# Altium project ANT_Miner_V1.3.PrjPCB (part 2 of 2)

## Sheet HashUnit2.SchDoc: ANT_Miner_V1.3
size A2; Date: 2013/11/20; DrawnBy: Bitmain Technology; SheetNumber: 7; SheetTotal: 9
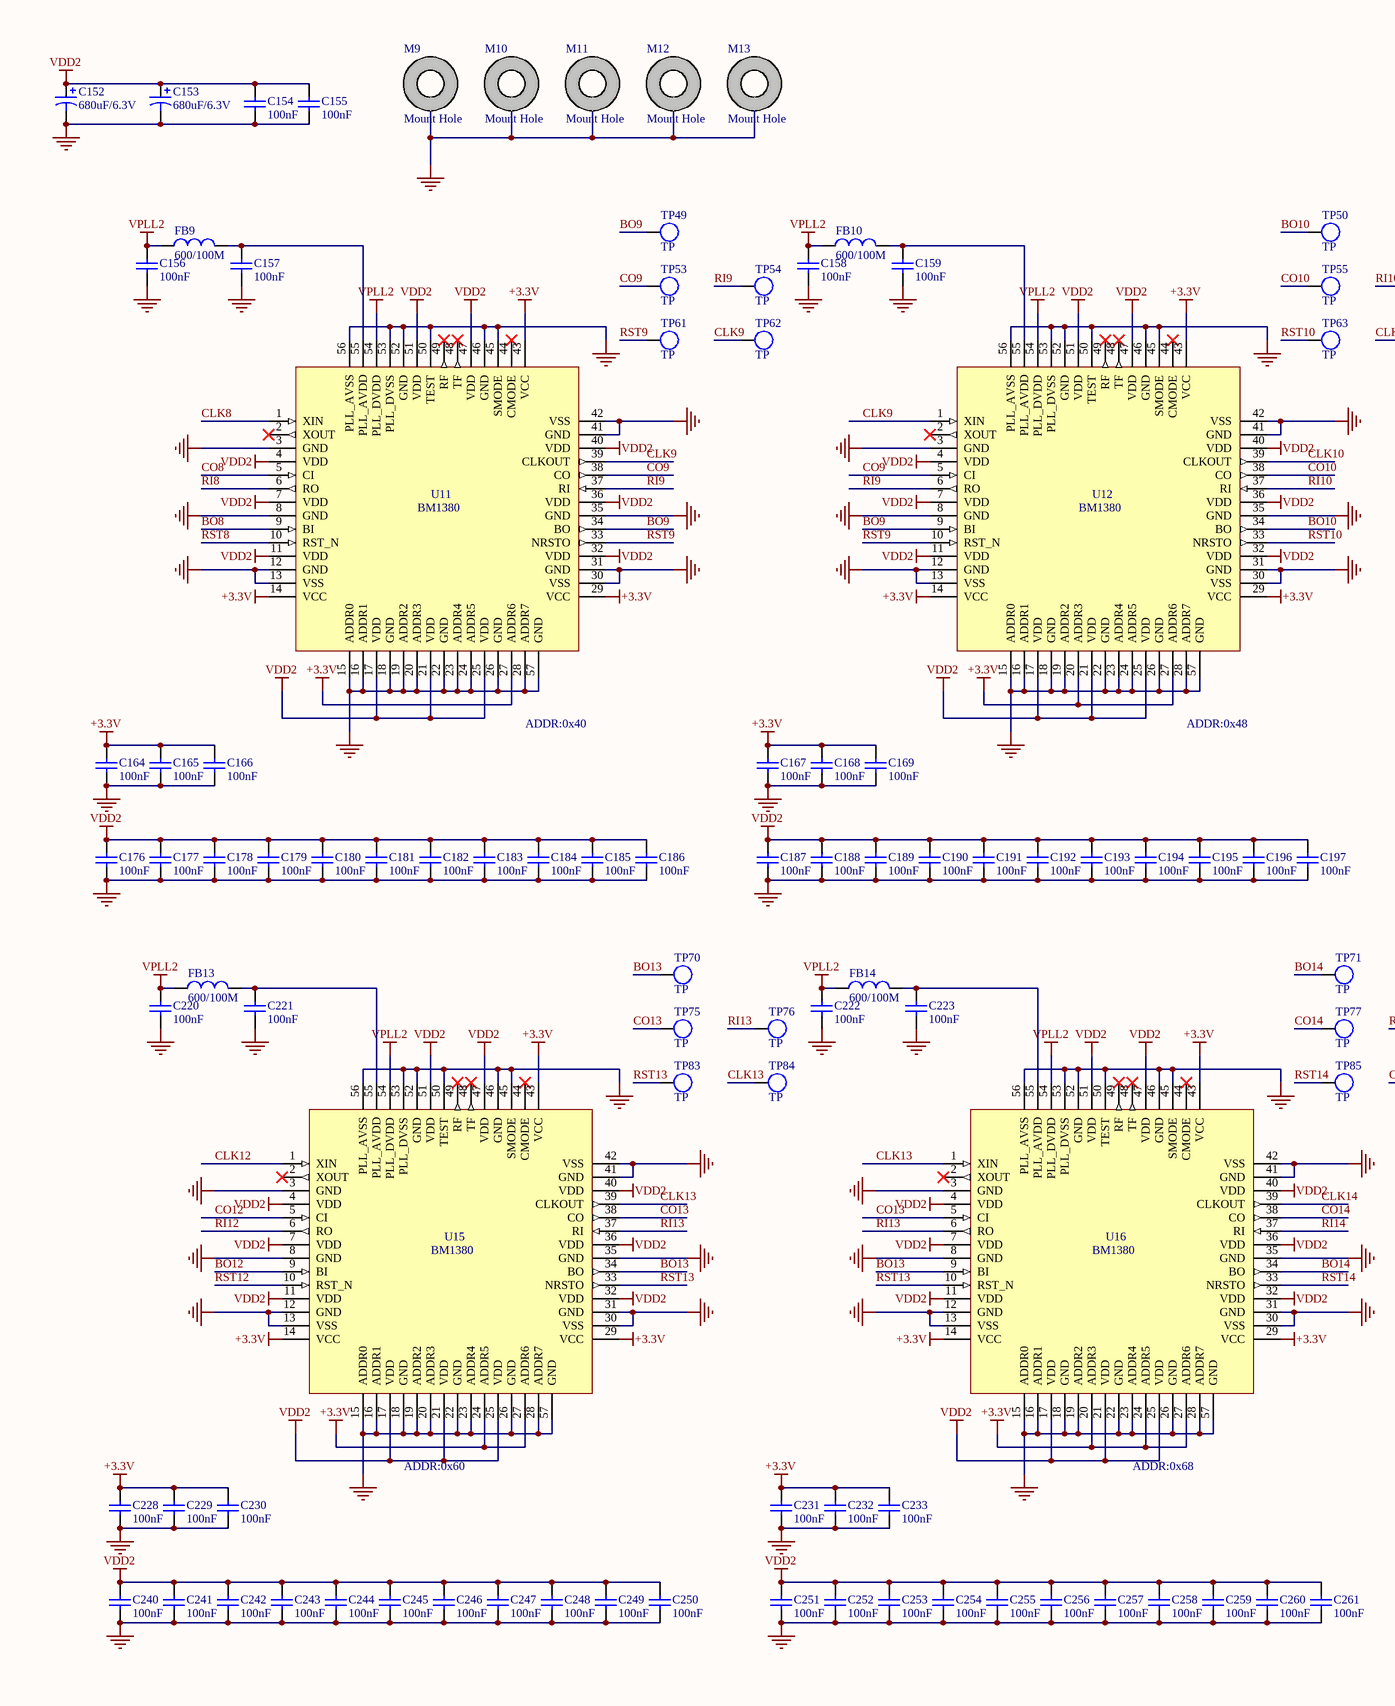
[diagram p7: HashUnit2.SchDoc, left]
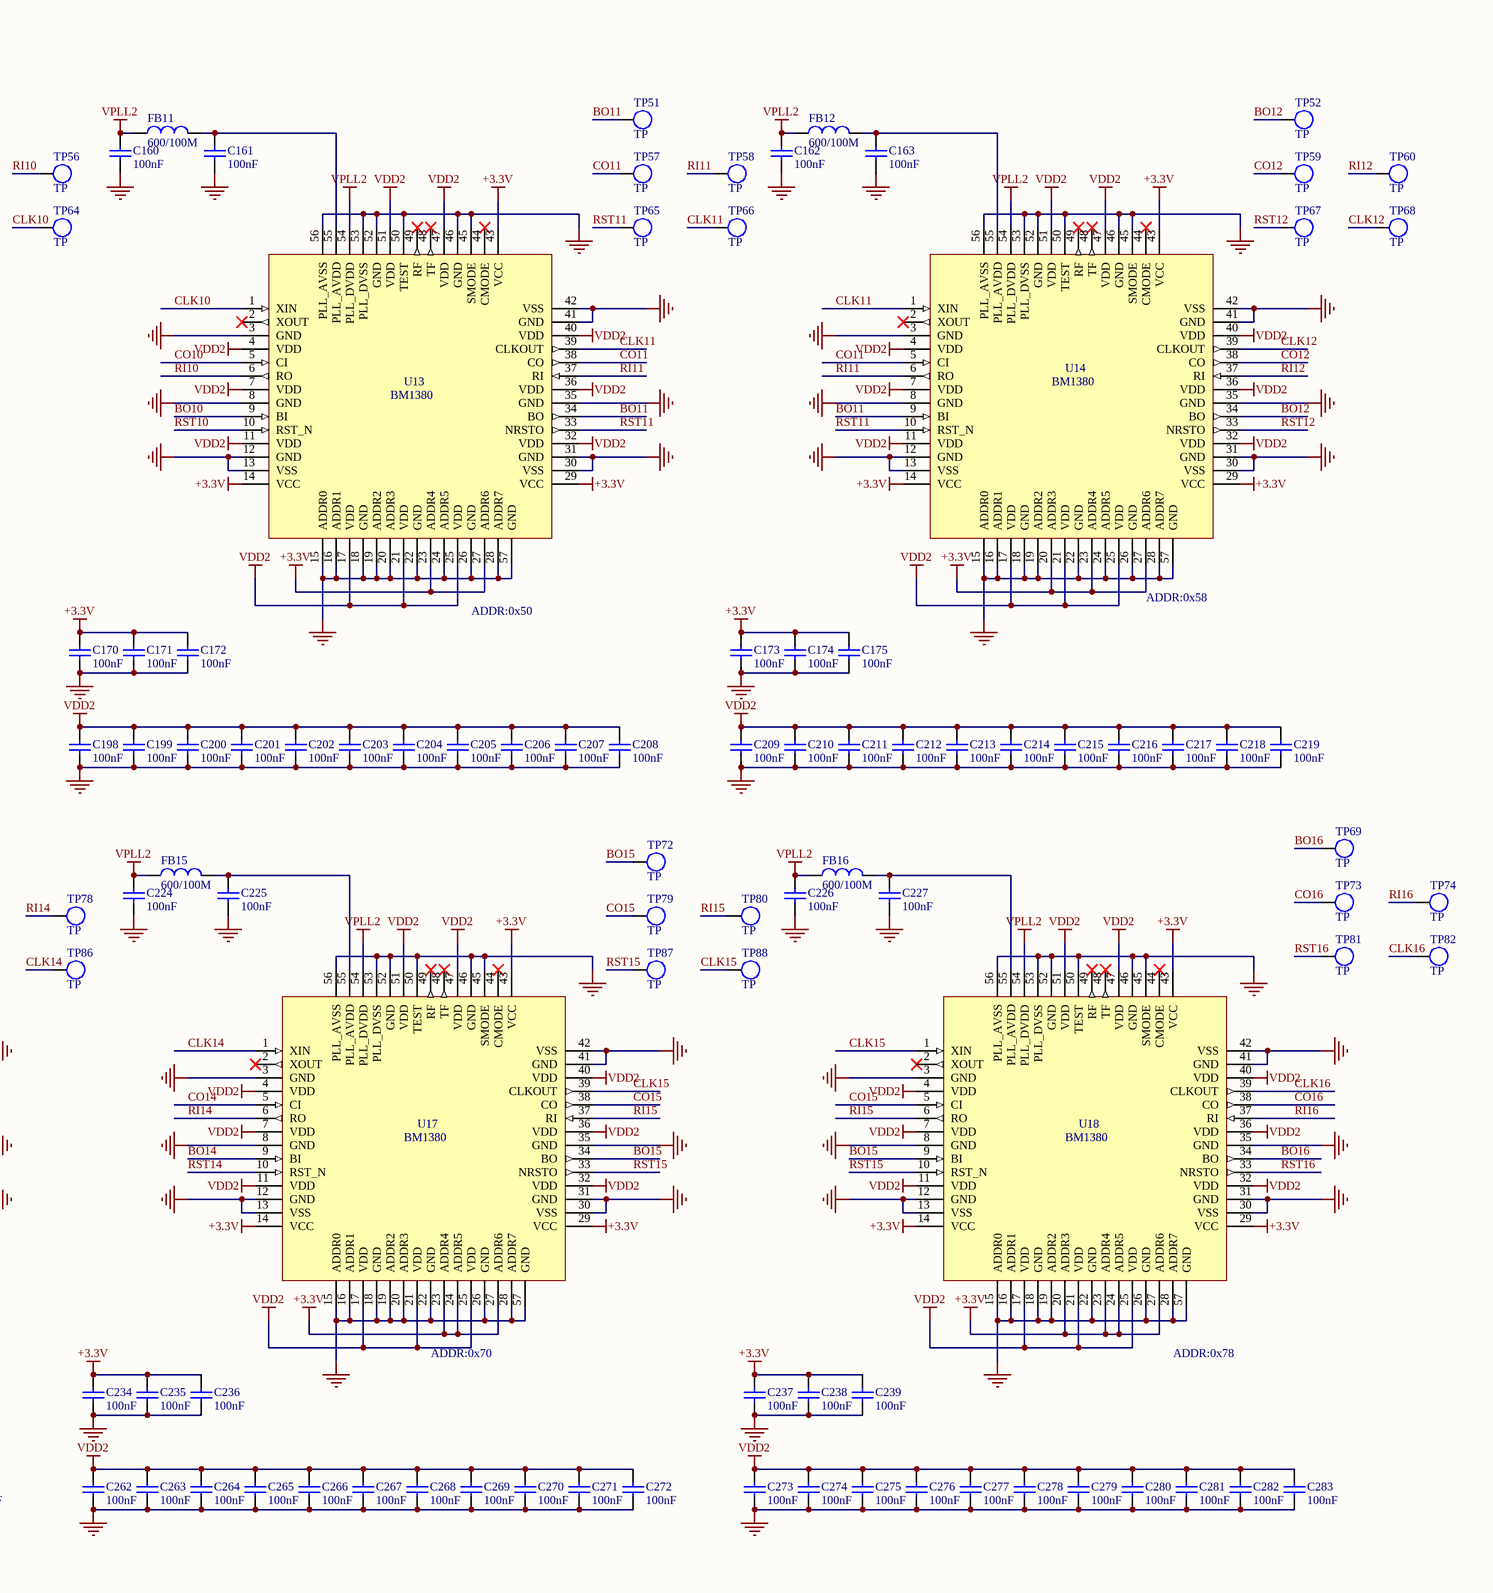
[diagram p8: HashUnit2.SchDoc, right]

### Parts
C152  680uF/6.3V  [D]
C153  680uF/6.3V  [D]
C154  100nF  [CC0603(1608)]
C155  100nF  [CC0603(1608)]
C156  100nF  [CC0603(1608)]
C157  100nF  [CC0603(1608)]
C158  100nF  [CC0603(1608)]
C159  100nF  [CC0603(1608)]
C160  100nF  [CC0603(1608)]
C161  100nF  [CC0603(1608)]
C162  100nF  [CC0603(1608)]
C163  100nF  [CC0603(1608)]
C164  100nF  [CC0603(1608)]
C165  100nF  [CC0603(1608)]
C166  100nF  [CC0603(1608)]
C167  100nF  [CC0603(1608)]
C168  100nF  [CC0603(1608)]
C169  100nF  [CC0603(1608)]
C170  100nF  [CC0603(1608)]
C171  100nF  [CC0603(1608)]
C172  100nF  [CC0603(1608)]
C173  100nF  [CC0603(1608)]
C174  100nF  [CC0603(1608)]
C175  100nF  [CC0603(1608)]
C176  100nF  [CC0603(1608)]
C177  100nF  [CC0603(1608)]
C178  100nF  [CC0603(1608)]
C179  100nF  [CC0603(1608)]
C180  100nF  [CC0603(1608)]
C181  100nF  [CC0603(1608)]
C182  100nF  [CC0603(1608)]
C183  100nF  [CC0603(1608)]
C184  100nF  [CC0603(1608)]
C185  100nF  [CC0603(1608)]
C186  100nF  [CC0603(1608)]
C187  100nF  [CC0603(1608)]
C188  100nF  [CC0603(1608)]
C189  100nF  [CC0603(1608)]
C190  100nF  [CC0603(1608)]
C191  100nF  [CC0603(1608)]
C192  100nF  [CC0603(1608)]
C193  100nF  [CC0603(1608)]
C194  100nF  [CC0603(1608)]
C195  100nF  [CC0603(1608)]
C196  100nF  [CC0603(1608)]
C197  100nF  [CC0603(1608)]
C198  100nF  [CC0603(1608)]
C199  100nF  [CC0603(1608)]
C200  100nF  [CC0603(1608)]
C201  100nF  [CC0603(1608)]
C202  100nF  [CC0603(1608)]
C203  100nF  [CC0603(1608)]
C204  100nF  [CC0603(1608)]
C205  100nF  [CC0603(1608)]
C206  100nF  [CC0603(1608)]
C207  100nF  [CC0603(1608)]
C208  100nF  [CC0603(1608)]
C209  100nF  [CC0603(1608)]
C210  100nF  [CC0603(1608)]
C211  100nF  [CC0603(1608)]
C212  100nF  [CC0603(1608)]
C213  100nF  [CC0603(1608)]
C214  100nF  [CC0603(1608)]
C215  100nF  [CC0603(1608)]
C216  100nF  [CC0603(1608)]
C217  100nF  [CC0603(1608)]
C218  100nF  [CC0603(1608)]
C219  100nF  [CC0603(1608)]
C220  100nF  [CC0603(1608)]
C221  100nF  [CC0603(1608)]
C222  100nF  [CC0603(1608)]
C223  100nF  [CC0603(1608)]
C224  100nF  [CC0603(1608)]
C225  100nF  [CC0603(1608)]
C226  100nF  [CC0603(1608)]
C227  100nF  [CC0603(1608)]
C228  100nF  [CC0603(1608)]
C229  100nF  [CC0603(1608)]
C230  100nF  [CC0603(1608)]
C231  100nF  [CC0603(1608)]
C232  100nF  [CC0603(1608)]
C233  100nF  [CC0603(1608)]
C234  100nF  [CC0603(1608)]
C235  100nF  [CC0603(1608)]
C236  100nF  [CC0603(1608)]
C237  100nF  [CC0603(1608)]
C238  100nF  [CC0603(1608)]
C239  100nF  [CC0603(1608)]
C240  100nF  [CC0603(1608)]
C241  100nF  [CC0603(1608)]
C242  100nF  [CC0603(1608)]
C243  100nF  [CC0603(1608)]
C244  100nF  [CC0603(1608)]
C245  100nF  [CC0603(1608)]
C246  100nF  [CC0603(1608)]
C247  100nF  [CC0603(1608)]
C248  100nF  [CC0603(1608)]
C249  100nF  [CC0603(1608)]
C250  100nF  [CC0603(1608)]
C251  100nF  [CC0603(1608)]
C252  100nF  [CC0603(1608)]
C253  100nF  [CC0603(1608)]
C254  100nF  [CC0603(1608)]
C255  100nF  [CC0603(1608)]
C256  100nF  [CC0603(1608)]
C257  100nF  [CC0603(1608)]
C258  100nF  [CC0603(1608)]
C259  100nF  [CC0603(1608)]
C260  100nF  [CC0603(1608)]
C261  100nF  [CC0603(1608)]
C262  100nF  [CC0603(1608)]
C263  100nF  [CC0603(1608)]
C264  100nF  [CC0603(1608)]
C265  100nF  [CC0603(1608)]
C266  100nF  [CC0603(1608)]
C267  100nF  [CC0603(1608)]
C268  100nF  [CC0603(1608)]
C269  100nF  [CC0603(1608)]
C270  100nF  [CC0603(1608)]
C271  100nF  [CC0603(1608)]
C272  100nF  [CC0603(1608)]
C273  100nF  [CC0603(1608)]
C274  100nF  [CC0603(1608)]
C275  100nF  [CC0603(1608)]
C276  100nF  [CC0603(1608)]
C277  100nF  [CC0603(1608)]
C278  100nF  [CC0603(1608)]
C279  100nF  [CC0603(1608)]
C280  100nF  [CC0603(1608)]
C281  100nF  [CC0603(1608)]
C282  100nF  [CC0603(1608)]
C283  100nF  [CC0603(1608)]
FB9  600/100M  [FB0603(1608)]
FB10  600/100M  [FB0603(1608)]
FB11  600/100M  [FB0603(1608)]
FB12  600/100M  [FB0603(1608)]
FB13  600/100M  [FB0603(1608)]
FB14  600/100M  [FB0603(1608)]
FB15  600/100M  [FB0603(1608)]
FB16  600/100M  [FB0603(1608)]
M9  Mount Hole  [MHOLE2]
M10  Mount Hole  [MHOLE2]
M11  Mount Hole  [MHOLE2]
M12  Mount Hole  [MHOLE2]
M13  Mount Hole  [MHOLE2]
TP49  TP  [TP_SMD]
TP50  TP  [TP_SMD]
TP51  TP  [TP_SMD]
TP52  TP  [TP_SMD]
TP53  TP  [TP_SMD]
TP54  TP  [TP_SMD]
TP55  TP  [TP_SMD]
TP56  TP  [TP_SMD]
TP57  TP  [TP_SMD]
TP58  TP  [TP_SMD]
TP59  TP  [TP_SMD]
TP60  TP  [TP_SMD]
TP61  TP  [TP_SMD]
TP62  TP  [TP_SMD]
TP63  TP  [TP_SMD]
TP64  TP  [TP_SMD]
TP65  TP  [TP_SMD]
TP66  TP  [TP_SMD]
TP67  TP  [TP_SMD]
TP68  TP  [TP_SMD]
TP69  TP  [TP_SMD]
TP70  TP  [TP_SMD]
TP71  TP  [TP_SMD]
TP72  TP  [TP_SMD]
TP73  TP  [TP_SMD]
TP74  TP  [TP_SMD]
TP75  TP  [TP_SMD]
TP76  TP  [TP_SMD]
TP77  TP  [TP_SMD]
TP78  TP  [TP_SMD]
TP79  TP  [TP_SMD]
TP80  TP  [TP_SMD]
TP81  TP  [TP_SMD]
TP82  TP  [TP_SMD]
TP83  TP  [TP_SMD]
TP84  TP  [TP_SMD]
TP85  TP  [TP_SMD]
TP86  TP  [TP_SMD]
TP87  TP  [TP_SMD]
TP88  TP  [TP_SMD]
U11  BM1380  [QFN56]
U12  BM1380  [QFN56]
U13  BM1380  [QFN56]
U14  BM1380  [QFN56]
U15  BM1380  [QFN56]
U16  BM1380  [QFN56]
U17  BM1380  [QFN56]
U18  BM1380  [QFN56]

### Nets
+3.3V: C164.2 C165.2 C166.2 C167.2 C168.2 C169.2 C170.2 C171.2 C172.2 C173.2 C174.2 C175.2 C228.2 C229.2 C230.2 C231.2 C232.2 C233.2 C234.2 C235.2 C236.2 C237.2 C238.2 C239.2 U11.14(VCC) U11.27(ADDR6) U11.29(VCC) U11.43(VCC) U12.14(VCC) U12.20(ADDR3) U12.27(ADDR6) U12.29(VCC) U12.43(VCC) U13.14(VCC) U13.23(ADDR4) U13.27(ADDR6) U13.29(VCC) U13.43(VCC) U14.14(VCC) U14.20(ADDR3) U14.23(ADDR4) U14.27(ADDR6) U14.29(VCC) U14.43(VCC) U15.14(VCC) U15.24(ADDR5) U15.27(ADDR6) U15.29(VCC) U15.43(VCC) U16.14(VCC) U16.20(ADDR3) U16.24(ADDR5) U16.27(ADDR6) U16.29(VCC) U16.43(VCC) U17.14(VCC) U17.23(ADDR4) U17.24(ADDR5) U17.27(ADDR6) U17.29(VCC) U17.43(VCC) U18.14(VCC) U18.20(ADDR3) U18.23(ADDR4) U18.24(ADDR5) U18.27(ADDR6) U18.29(VCC) U18.43(VCC)
GND: C152.2 C153.2 C154.1 C155.1 C156.2 C157.1 C158.2 C159.1 C160.2 C161.1 C162.2 C163.1 C164.1 C165.1 C166.1 C167.1 C168.1 C169.1 C170.1 C171.1 C172.1 C173.1 C174.1 C175.1 C176.1 C177.1 C178.1 C179.1 C180.1 C181.1 C182.1 C183.1 C184.1 C185.1 C186.1 C187.1 C188.1 C189.1 C190.1 C191.1 C192.1 C193.1 C194.1 C195.1 C196.1 C197.1 C198.1 C199.1 C200.1 C201.1 C202.1 C203.1 C204.1 C205.1 C206.1 C207.1 C208.1 C209.1 C210.1 C211.1 C212.1 C213.1 C214.1 C215.1 C216.1 C217.1 C218.1 C219.1 C220.2 C221.1 C222.2 C223.1 C224.2 C225.1 C226.2 C227.1 C228.1 C229.1 C230.1 C231.1 C232.1 C233.1 C234.1 C235.1 C236.1 C237.1 C238.1 C239.1 C240.1 C241.1 C242.1 C243.1 C244.1 C245.1 C246.1 C247.1 C248.1 C249.1 C250.1 C251.1 C252.1 C253.1 C254.1 C255.1 C256.1 C257.1 C258.1 C259.1 C260.1 C261.1 C262.1 C263.1 C264.1 C265.1 C266.1 C267.1 C268.1 C269.1 C270.1 C271.1 C272.1 C273.1 C274.1 C275.1 C276.1 C277.1 C278.1 C279.1 C280.1 C281.1 C282.1 C283.1 M9.0(PIN) M10.0(PIN) M11.0(PIN) M12.0(PIN) M13.0(PIN) U11.3(GND) U11.8(GND) U11.12(GND) U11.13(VSS) U11.15(ADDR0) U11.16(ADDR1) U11.18(GND) U11.19(ADDR2) U11.20(ADDR3) U11.22(GND) U11.23(ADDR4) U11.24(ADDR5) U11.26(GND) U11.28(ADDR7) U11.30(VSS) U11.31(GND) U11.35(GND) U11.41(GND) U11.42(VSS) U11.45(SMODE) U11.46(GND) U11.50(TEST) U11.52(GND) U11.53(PLL_DVSS) U11.56(PLL_AVSS) U11.57(GND) U12.3(GND) U12.8(GND) U12.12(GND) U12.13(VSS) U12.15(ADDR0) U12.16(ADDR1) U12.18(GND) U12.19(ADDR2) U12.22(GND) U12.23(ADDR4) U12.24(ADDR5) U12.26(GND) U12.28(ADDR7) U12.30(VSS) U12.31(GND) U12.35(GND) U12.41(GND) U12.42(VSS) U12.45(SMODE) U12.46(GND) U12.50(TEST) U12.52(GND) U12.53(PLL_DVSS) U12.56(PLL_AVSS) U12.57(GND) U13.3(GND) U13.8(GND) U13.12(GND) U13.13(VSS) U13.15(ADDR0) U13.16(ADDR1) U13.18(GND) U13.19(ADDR2) U13.20(ADDR3) U13.22(GND) U13.24(ADDR5) U13.26(GND) U13.28(ADDR7) U13.30(VSS) U13.31(GND) U13.35(GND) U13.41(GND) U13.42(VSS) U13.45(SMODE) U13.46(GND) U13.50(TEST) U13.52(GND) U13.53(PLL_DVSS) U13.56(PLL_AVSS) U13.57(GND) U14.3(GND) U14.8(GND) U14.12(GND) U14.13(VSS) U14.15(ADDR0) U14.16(ADDR1) U14.18(GND) U14.19(ADDR2) U14.22(GND) U14.24(ADDR5) U14.26(GND) U14.28(ADDR7) U14.30(VSS) U14.31(GND) U14.35(GND) U14.41(GND) U14.42(VSS) U14.45(SMODE) U14.46(GND) U14.50(TEST) U14.52(GND) U14.53(PLL_DVSS) U14.56(PLL_AVSS) U14.57(GND) U15.3(GND) U15.8(GND) U15.12(GND) U15.13(VSS) U15.15(ADDR0) U15.16(ADDR1) U15.18(GND) U15.19(ADDR2) U15.20(ADDR3) U15.22(GND) U15.23(ADDR4) U15.26(GND) U15.28(ADDR7) U15.30(VSS) U15.31(GND) U15.35(GND) U15.41(GND) U15.42(VSS) U15.45(SMODE) U15.46(GND) U15.50(TEST) U15.52(GND) U15.53(PLL_DVSS) U15.56(PLL_AVSS) U15.57(GND) U16.3(GND) U16.8(GND) U16.12(GND) U16.13(VSS) U16.15(ADDR0) U16.16(ADDR1) U16.18(GND) U16.19(ADDR2) U16.22(GND) U16.23(ADDR4) U16.26(GND) U16.28(ADDR7) U16.30(VSS) U16.31(GND) U16.35(GND) U16.41(GND) U16.42(VSS) U16.45(SMODE) U16.46(GND) U16.50(TEST) U16.52(GND) U16.53(PLL_DVSS) U16.56(PLL_AVSS) U16.57(GND) U17.3(GND) U17.8(GND) U17.12(GND) U17.13(VSS) U17.15(ADDR0) U17.16(ADDR1) U17.18(GND) U17.19(ADDR2) U17.20(ADDR3) U17.22(GND) U17.26(GND) U17.28(ADDR7) U17.30(VSS) U17.31(GND) U17.35(GND) U17.41(GND) U17.42(VSS) U17.45(SMODE) U17.46(GND) U17.50(TEST) U17.52(GND) U17.53(PLL_DVSS) U17.56(PLL_AVSS) U17.57(GND) U18.3(GND) U18.8(GND) U18.12(GND) U18.13(VSS) U18.15(ADDR0) U18.16(ADDR1) U18.18(GND) U18.19(ADDR2) U18.22(GND) U18.26(GND) U18.28(ADDR7) U18.30(VSS) U18.31(GND) U18.35(GND) U18.41(GND) U18.42(VSS) U18.45(SMODE) U18.46(GND) U18.50(TEST) U18.52(GND) U18.53(PLL_DVSS) U18.56(PLL_AVSS) U18.57(GND)
VDD2: C152.1 C153.1 C154.2 C155.2 C176.2 C177.2 C178.2 C179.2 C180.2 C181.2 C182.2 C183.2 C184.2 C185.2 C186.2 C187.2 C188.2 C189.2 C190.2 C191.2 C192.2 C193.2 C194.2 C195.2 C196.2 C197.2 C198.2 C199.2 C200.2 C201.2 C202.2 C203.2 C204.2 C205.2 C206.2 C207.2 C208.2 C209.2 C210.2 C211.2 C212.2 C213.2 C214.2 C215.2 C216.2 C217.2 C218.2 C219.2 C240.2 C241.2 C242.2 C243.2 C244.2 C245.2 C246.2 C247.2 C248.2 C249.2 C250.2 C251.2 C252.2 C253.2 C254.2 C255.2 C256.2 C257.2 C258.2 C259.2 C260.2 C261.2 C262.2 C263.2 C264.2 C265.2 C266.2 C267.2 C268.2 C269.2 C270.2 C271.2 C272.2 C273.2 C274.2 C275.2 C276.2 C277.2 C278.2 C279.2 C280.2 C281.2 C282.2 C283.2 U11.4(VDD) U11.7(VDD) U11.11(VDD) U11.17(VDD) U11.21(VDD) U11.25(VDD) U11.32(VDD) U11.36(VDD) U11.40(VDD) U11.47(VDD) U11.51(VDD) U12.4(VDD) U12.7(VDD) U12.11(VDD) U12.17(VDD) U12.21(VDD) U12.25(VDD) U12.32(VDD) U12.36(VDD) U12.40(VDD) U12.47(VDD) U12.51(VDD) U13.4(VDD) U13.7(VDD) U13.11(VDD) U13.17(VDD) U13.21(VDD) U13.25(VDD) U13.32(VDD) U13.36(VDD) U13.40(VDD) U13.47(VDD) U13.51(VDD) U14.4(VDD) U14.7(VDD) U14.11(VDD) U14.17(VDD) U14.21(VDD) U14.25(VDD) U14.32(VDD) U14.36(VDD) U14.40(VDD) U14.47(VDD) U14.51(VDD) U15.4(VDD) U15.7(VDD) U15.11(VDD) U15.17(VDD) U15.21(VDD) U15.25(VDD) U15.32(VDD) U15.36(VDD) U15.40(VDD) U15.47(VDD) U15.51(VDD) U16.4(VDD) U16.7(VDD) U16.11(VDD) U16.17(VDD) U16.21(VDD) U16.25(VDD) U16.32(VDD) U16.36(VDD) U16.40(VDD) U16.47(VDD) U16.51(VDD) U17.4(VDD) U17.7(VDD) U17.11(VDD) U17.17(VDD) U17.21(VDD) U17.25(VDD) U17.32(VDD) U17.36(VDD) U17.40(VDD) U17.47(VDD) U17.51(VDD) U18.4(VDD) U18.7(VDD) U18.11(VDD) U18.17(VDD) U18.21(VDD) U18.25(VDD) U18.32(VDD) U18.36(VDD) U18.40(VDD) U18.47(VDD) U18.51(VDD)
VPLL2: C156.1 C158.1 C160.1 C162.1 C220.1 C222.1 C224.1 C226.1 FB9.2 FB10.2 FB11.2 FB12.2 FB13.2 FB14.2 FB15.2 FB16.2 U11.54(PLL_DVDD) U12.54(PLL_DVDD) U13.54(PLL_DVDD) U14.54(PLL_DVDD) U15.54(PLL_DVDD) U16.54(PLL_DVDD) U17.54(PLL_DVDD) U18.54(PLL_DVDD)
BO8: U11.9(BI)
BO9: TP49.1 U11.34(BO) U12.9(BI)
BO10: TP50.1 U12.34(BO) U13.9(BI)
BO11: TP51.1 U13.34(BO) U14.9(BI)
BO12: TP52.1 U14.34(BO) U15.9(BI)
BO13: TP70.1 U15.34(BO) U16.9(BI)
BO14: TP71.1 U16.34(BO) U17.9(BI)
BO15: TP72.1 U17.34(BO) U18.9(BI)
BO16: TP69.1 U18.34(BO)
CLK8: U11.1(XIN)
CLK9: TP62.1 U11.39(CLKOUT) U12.1(XIN)
CLK10: TP64.1 U12.39(CLKOUT) U13.1(XIN)
CLK11: TP66.1 U13.39(CLKOUT) U14.1(XIN)
CLK12: TP68.1 U14.39(CLKOUT) U15.1(XIN)
CLK13: TP84.1 U15.39(CLKOUT) U16.1(XIN)
CLK14: TP86.1 U16.39(CLKOUT) U17.1(XIN)
CLK15: TP88.1 U17.39(CLKOUT) U18.1(XIN)
CLK16: TP82.1 U18.39(CLKOUT)
CO8: U11.5(CI)
CO9: TP53.1 U11.38(CO) U12.5(CI)
CO10: TP55.1 U12.38(CO) U13.5(CI)
CO11: TP57.1 U13.38(CO) U14.5(CI)
CO12: TP59.1 U14.38(CO) U15.5(CI)
CO13: TP75.1 U15.38(CO) U16.5(CI)
CO14: TP77.1 U16.38(CO) U17.5(CI)
CO15: TP79.1 U17.38(CO) U18.5(CI)
CO16: TP73.1 U18.38(CO)
RI8: U11.6(RO)
RI9: TP54.1 U11.37(RI) U12.6(RO)
RI10: TP56.1 U12.37(RI) U13.6(RO)
RI11: TP58.1 U13.37(RI) U14.6(RO)
RI12: TP60.1 U14.37(RI) U15.6(RO)
RI13: TP76.1 U15.37(RI) U16.6(RO)
RI14: TP78.1 U16.37(RI) U17.6(RO)
RI15: TP80.1 U17.37(RI) U18.6(RO)
RI16: TP74.1 U18.37(RI)
RST8: U11.10(RST_N)
RST9: TP61.1 U11.33(NRSTO) U12.10(RST_N)
RST10: TP63.1 U12.33(NRSTO) U13.10(RST_N)
RST11: TP65.1 U13.33(NRSTO) U14.10(RST_N)
RST12: TP67.1 U14.33(NRSTO) U15.10(RST_N)
RST13: TP83.1 U15.33(NRSTO) U16.10(RST_N)
RST14: TP85.1 U16.33(NRSTO) U17.10(RST_N)
RST15: TP87.1 U17.33(NRSTO) U18.10(RST_N)
RST16: TP81.1 U18.33(NRSTO)
NetC157_2: C157.2 FB9.1 U11.55(PLL_AVDD)
NetC159_2: C159.2 FB10.1 U12.55(PLL_AVDD)
NetC161_2: C161.2 FB11.1 U13.55(PLL_AVDD)
NetC163_2: C163.2 FB12.1 U14.55(PLL_AVDD)
NetC221_2: C221.2 FB13.1 U15.55(PLL_AVDD)
NetC223_2: C223.2 FB14.1 U16.55(PLL_AVDD)
NetC225_2: C225.2 FB15.1 U17.55(PLL_AVDD)
NetC227_2: C227.2 FB16.1 U18.55(PLL_AVDD)

Not connected (* = marked no-connect by the designer): U11 2(XOUT)* 44(CMODE)* 48(TF)* 49(RF)*; U12 2(XOUT)* 44(CMODE)* 48(TF)* 49(RF)*; U13 2(XOUT)* 44(CMODE)* 48(TF)* 49(RF)*; U14 2(XOUT)* 44(CMODE)* 48(TF)* 49(RF)*; U15 2(XOUT)* 44(CMODE)* 48(TF)* 49(RF)*; U16 2(XOUT)* 44(CMODE)* 48(TF)* 49(RF)*; U17 2(XOUT)* 44(CMODE)* 48(TF)* 49(RF)*; U18 2(XOUT)* 44(CMODE)* 48(TF)* 49(RF)*

### Notes on the sheet
- ADDR:0x40
- ADDR:0x48
- ADDR:0x50
- ADDR:0x58
- ADDR:0x60
- ADDR:0x68
- ADDR:0x70
- ADDR:0x78

### Library data of the parts
C152 C153 = T492C: as C17 on sheet HashUnit1; Published: 17-Jul-2002; LatestRevisionDate: 19-Mar-2004; LatestRevisionNote: Silkscreen dimensions re-sized.; DatasheetDocument: Mar-2001; PackageDocument: Mar-2001; PackageReference: C; Publisher: Altium Limited; Code_JEITA: 6032-28; ComponentLink1Description: Manufacturer Link; ComponentLink1URL: http://www.kemet.com/; ComponentLink2Description: Datasheet; ComponentLink2URL: http://www.kemet.com/kemet/web/homepage/kechome.nsf/vapubfilesname/F3102TA.pdf/$file/F3102TA.pdf; Value: 680uF/6.3V
C154 C155 = Cap Semi: Capacitor (Semiconductor SIM Model); Published: 8-Jun-2000; LatestRevisionDate: 29-May-2009; LatestRevisionNote: IPC-7351 Footprint Added.; PackageReference: C1206; Publisher: Altium Limited; PackageDescription: Chip Capacitor; Value: 100nF
C156-C283 = Cap: Capacitor; Published: 8-Jun-2000; LatestRevisionDate: 17-Jul-2002; LatestRevisionNote: Re-released for DXP Platform.; PackageReference: RAD-0.3; Publisher: Altium Limited; PackageDescription: Radial Cap, Thru-Hole; 2 Leads; 0.3 in Pin Spacing; Value: 100nF
FB9-FB16 = FB: Inductor; Code_IEC: 1005; Published: 8-Jun-2000; LatestRevisionDate: 29-May-2009; LatestRevisionNote: IPC-7351 Footprint Added.; PackageReference: 0402-A; Publisher: Altium Limited; PackageDescription: Chip Inductor; Code_JEITA: 0402; Value: 600/100M
M9-M13 = M_Hole
TP49-TP88 = TP: Test Point; Value: TP

## Sheet HashUnit3.SchDoc: ANT_Miner_V1.3
size A2; Date: 2013/11/20; DrawnBy: Bitmain Technology; SheetNumber: 8; SheetTotal: 9
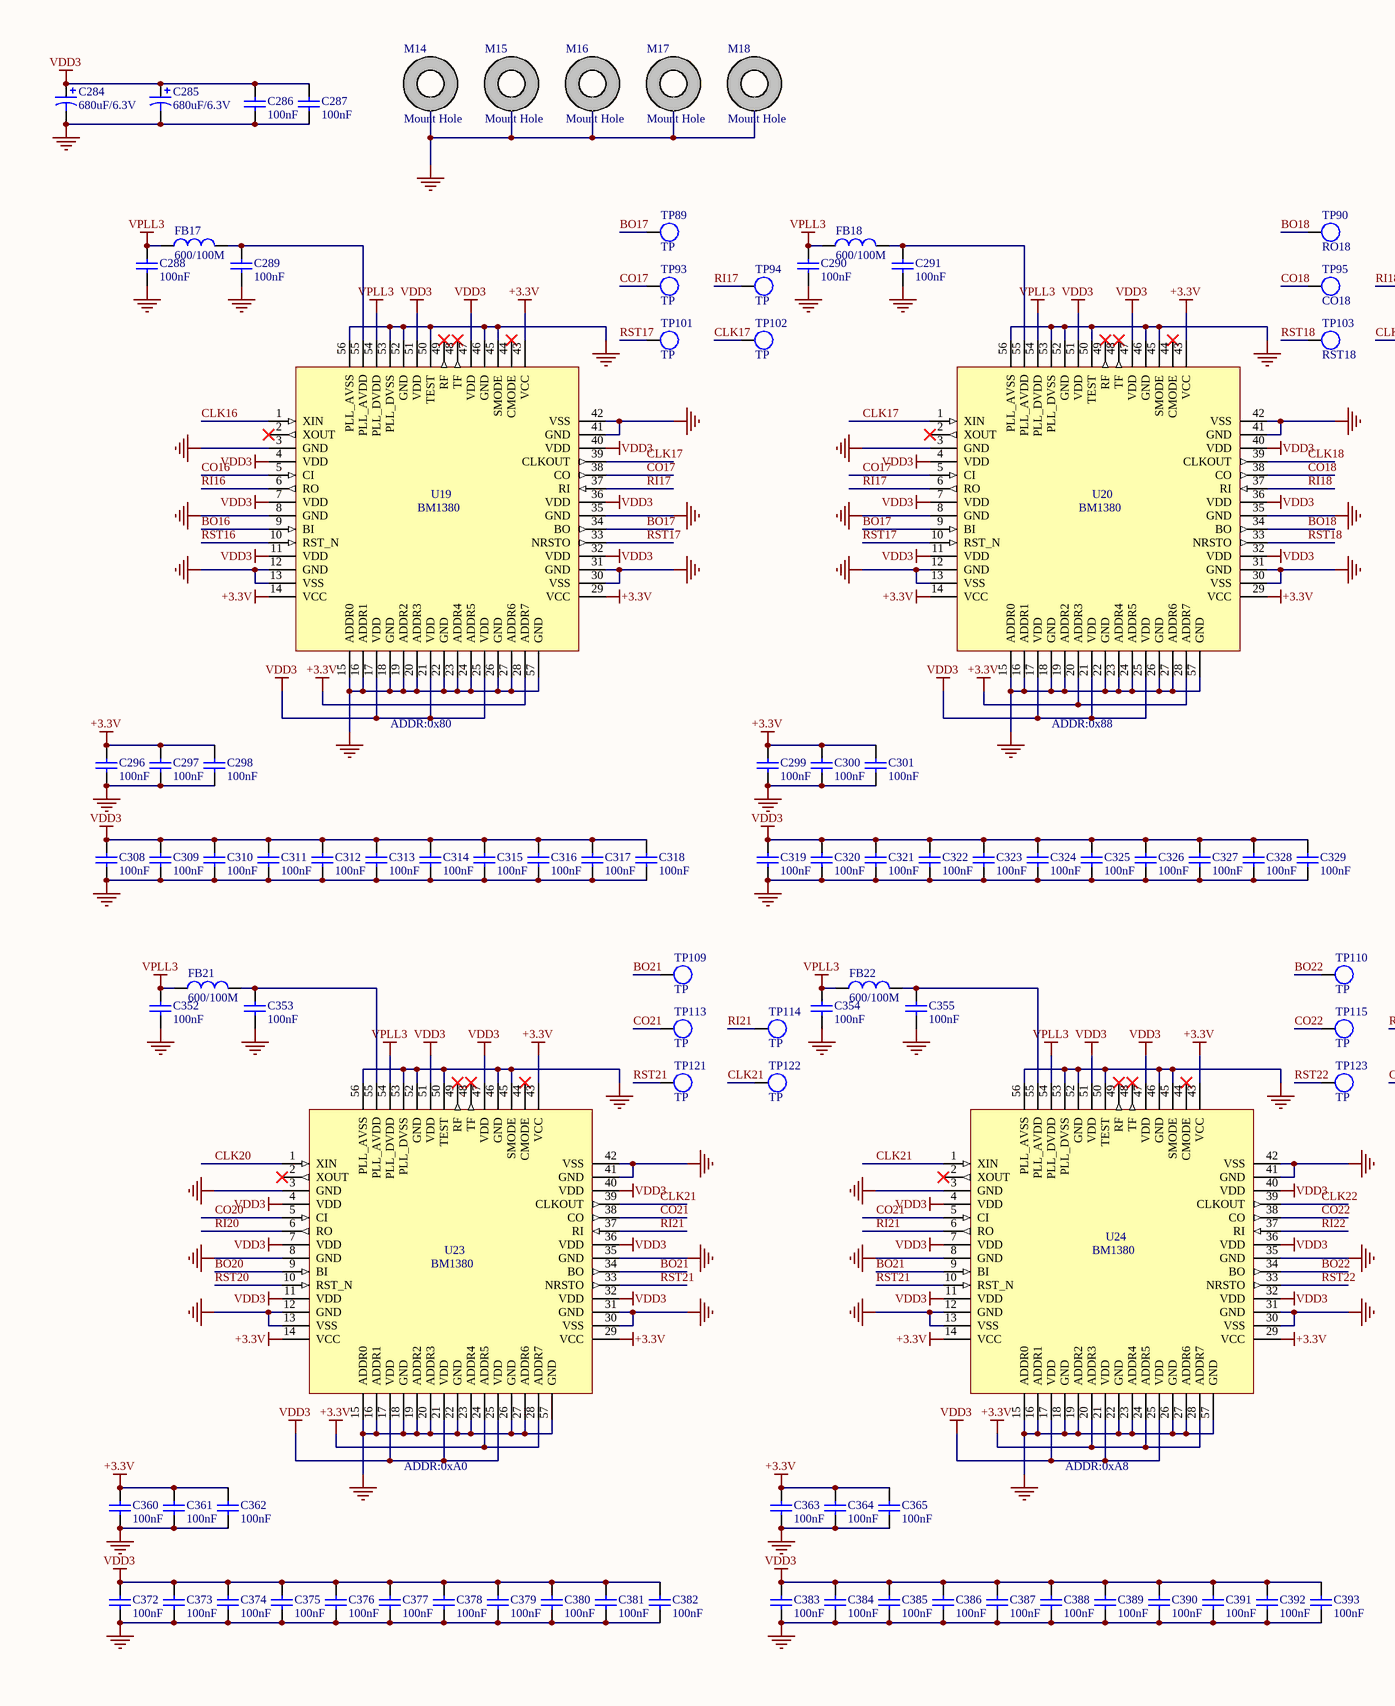
[diagram p9: HashUnit3.SchDoc, left]
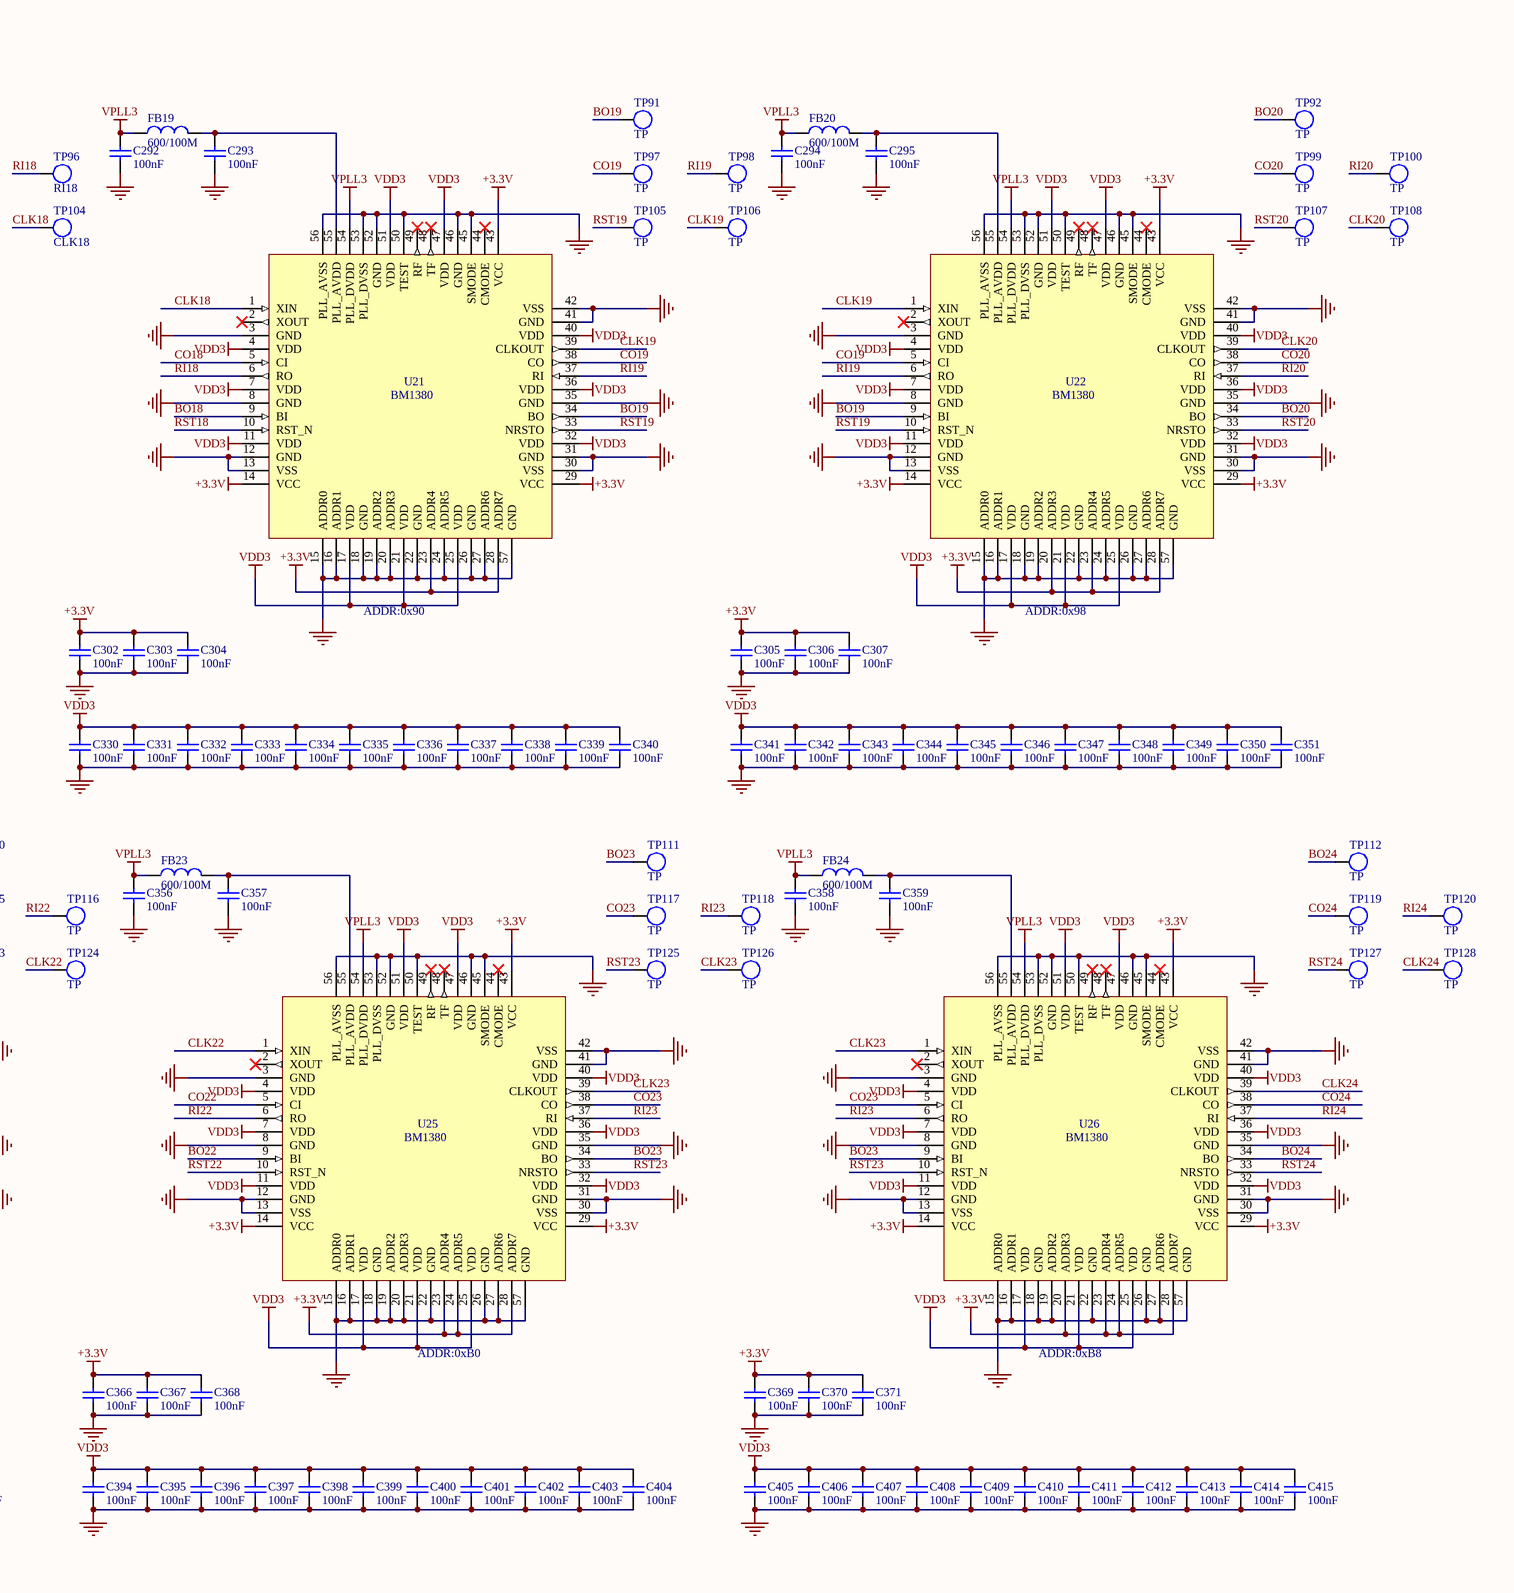
[diagram p10: HashUnit3.SchDoc, right]

### Parts
C284  680uF/6.3V  [D]
C285  680uF/6.3V  [D]
C286  100nF  [CC0603(1608)]
C287  100nF  [CC0603(1608)]
C288  100nF  [CC0603(1608)]
C289  100nF  [CC0603(1608)]
C290  100nF  [CC0603(1608)]
C291  100nF  [CC0603(1608)]
C292  100nF  [CC0603(1608)]
C293  100nF  [CC0603(1608)]
C294  100nF  [CC0603(1608)]
C295  100nF  [CC0603(1608)]
C296  100nF  [CC0603(1608)]
C297  100nF  [CC0603(1608)]
C298  100nF  [CC0603(1608)]
C299  100nF  [CC0603(1608)]
C300  100nF  [CC0603(1608)]
C301  100nF  [CC0603(1608)]
C302  100nF  [CC0603(1608)]
C303  100nF  [CC0603(1608)]
C304  100nF  [CC0603(1608)]
C305  100nF  [CC0603(1608)]
C306  100nF  [CC0603(1608)]
C307  100nF  [CC0603(1608)]
C308  100nF  [CC0603(1608)]
C309  100nF  [CC0603(1608)]
C310  100nF  [CC0603(1608)]
C311  100nF  [CC0603(1608)]
C312  100nF  [CC0603(1608)]
C313  100nF  [CC0603(1608)]
C314  100nF  [CC0603(1608)]
C315  100nF  [CC0603(1608)]
C316  100nF  [CC0603(1608)]
C317  100nF  [CC0603(1608)]
C318  100nF  [CC0603(1608)]
C319  100nF  [CC0603(1608)]
C320  100nF  [CC0603(1608)]
C321  100nF  [CC0603(1608)]
C322  100nF  [CC0603(1608)]
C323  100nF  [CC0603(1608)]
C324  100nF  [CC0603(1608)]
C325  100nF  [CC0603(1608)]
C326  100nF  [CC0603(1608)]
C327  100nF  [CC0603(1608)]
C328  100nF  [CC0603(1608)]
C329  100nF  [CC0603(1608)]
C330  100nF  [CC0603(1608)]
C331  100nF  [CC0603(1608)]
C332  100nF  [CC0603(1608)]
C333  100nF  [CC0603(1608)]
C334  100nF  [CC0603(1608)]
C335  100nF  [CC0603(1608)]
C336  100nF  [CC0603(1608)]
C337  100nF  [CC0603(1608)]
C338  100nF  [CC0603(1608)]
C339  100nF  [CC0603(1608)]
C340  100nF  [CC0603(1608)]
C341  100nF  [CC0603(1608)]
C342  100nF  [CC0603(1608)]
C343  100nF  [CC0603(1608)]
C344  100nF  [CC0603(1608)]
C345  100nF  [CC0603(1608)]
C346  100nF  [CC0603(1608)]
C347  100nF  [CC0603(1608)]
C348  100nF  [CC0603(1608)]
C349  100nF  [CC0603(1608)]
C350  100nF  [CC0603(1608)]
C351  100nF  [CC0603(1608)]
C352  100nF  [CC0603(1608)]
C353  100nF  [CC0603(1608)]
C354  100nF  [CC0603(1608)]
C355  100nF  [CC0603(1608)]
C356  100nF  [CC0603(1608)]
C357  100nF  [CC0603(1608)]
C358  100nF  [CC0603(1608)]
C359  100nF  [CC0603(1608)]
C360  100nF  [CC0603(1608)]
C361  100nF  [CC0603(1608)]
C362  100nF  [CC0603(1608)]
C363  100nF  [CC0603(1608)]
C364  100nF  [CC0603(1608)]
C365  100nF  [CC0603(1608)]
C366  100nF  [CC0603(1608)]
C367  100nF  [CC0603(1608)]
C368  100nF  [CC0603(1608)]
C369  100nF  [CC0603(1608)]
C370  100nF  [CC0603(1608)]
C371  100nF  [CC0603(1608)]
C372  100nF  [CC0603(1608)]
C373  100nF  [CC0603(1608)]
C374  100nF  [CC0603(1608)]
C375  100nF  [CC0603(1608)]
C376  100nF  [CC0603(1608)]
C377  100nF  [CC0603(1608)]
C378  100nF  [CC0603(1608)]
C379  100nF  [CC0603(1608)]
C380  100nF  [CC0603(1608)]
C381  100nF  [CC0603(1608)]
C382  100nF  [CC0603(1608)]
C383  100nF  [CC0603(1608)]
C384  100nF  [CC0603(1608)]
C385  100nF  [CC0603(1608)]
C386  100nF  [CC0603(1608)]
C387  100nF  [CC0603(1608)]
C388  100nF  [CC0603(1608)]
C389  100nF  [CC0603(1608)]
C390  100nF  [CC0603(1608)]
C391  100nF  [CC0603(1608)]
C392  100nF  [CC0603(1608)]
C393  100nF  [CC0603(1608)]
C394  100nF  [CC0603(1608)]
C395  100nF  [CC0603(1608)]
C396  100nF  [CC0603(1608)]
C397  100nF  [CC0603(1608)]
C398  100nF  [CC0603(1608)]
C399  100nF  [CC0603(1608)]
C400  100nF  [CC0603(1608)]
C401  100nF  [CC0603(1608)]
C402  100nF  [CC0603(1608)]
C403  100nF  [CC0603(1608)]
C404  100nF  [CC0603(1608)]
C405  100nF  [CC0603(1608)]
C406  100nF  [CC0603(1608)]
C407  100nF  [CC0603(1608)]
C408  100nF  [CC0603(1608)]
C409  100nF  [CC0603(1608)]
C410  100nF  [CC0603(1608)]
C411  100nF  [CC0603(1608)]
C412  100nF  [CC0603(1608)]
C413  100nF  [CC0603(1608)]
C414  100nF  [CC0603(1608)]
C415  100nF  [CC0603(1608)]
FB17  600/100M  [FB0603(1608)]
FB18  600/100M  [FB0603(1608)]
FB19  600/100M  [FB0603(1608)]
FB20  600/100M  [FB0603(1608)]
FB21  600/100M  [FB0603(1608)]
FB22  600/100M  [FB0603(1608)]
FB23  600/100M  [FB0603(1608)]
FB24  600/100M  [FB0603(1608)]
M14  Mount Hole  [MHOLE2]
M15  Mount Hole  [MHOLE2]
M16  Mount Hole  [MHOLE2]
M17  Mount Hole  [MHOLE2]
M18  Mount Hole  [MHOLE2]
TP89  TP  [TP_SMD]
TP90  value RO18  [TP_SMD]  (hidden comment: TP)
TP91  TP  [TP_SMD]
TP92  TP  [TP_SMD]
TP93  TP  [TP_SMD]
TP94  TP  [TP_SMD]
TP95  value CO18  [TP_SMD]  (hidden comment: TP)
TP96  value RI18  [TP_SMD]  (hidden comment: TP)
TP97  TP  [TP_SMD]
TP98  TP  [TP_SMD]
TP99  TP  [TP_SMD]
TP100  TP  [TP_SMD]
TP101  TP  [TP_SMD]
TP102  TP  [TP_SMD]
TP103  value RST18  [TP_SMD]  (hidden comment: TP)
TP104  value CLK18  [TP_SMD]  (hidden comment: TP)
TP105  TP  [TP_SMD]
TP106  TP  [TP_SMD]
TP107  TP  [TP_SMD]
TP108  TP  [TP_SMD]
TP109  TP  [TP_SMD]
TP110  TP  [TP_SMD]
TP111  TP  [TP_SMD]
TP112  TP  [TP_SMD]
TP113  TP  [TP_SMD]
TP114  TP  [TP_SMD]
TP115  TP  [TP_SMD]
TP116  TP  [TP_SMD]
TP117  TP  [TP_SMD]
TP118  TP  [TP_SMD]
TP119  TP  [TP_SMD]
TP120  TP  [TP_SMD]
TP121  TP  [TP_SMD]
TP122  TP  [TP_SMD]
TP123  TP  [TP_SMD]
TP124  TP  [TP_SMD]
TP125  TP  [TP_SMD]
TP126  TP  [TP_SMD]
TP127  TP  [TP_SMD]
TP128  TP  [TP_SMD]
U19  BM1380  [QFN56]
U20  BM1380  [QFN56]
U21  BM1380  [QFN56]
U22  BM1380  [QFN56]
U23  BM1380  [QFN56]
U24  BM1380  [QFN56]
U25  BM1380  [QFN56]
U26  BM1380  [QFN56]

### Nets
+3.3V: C296.2 C297.2 C298.2 C299.2 C300.2 C301.2 C302.2 C303.2 C304.2 C305.2 C306.2 C307.2 C360.2 C361.2 C362.2 C363.2 C364.2 C365.2 C366.2 C367.2 C368.2 C369.2 C370.2 C371.2 U19.14(VCC) U19.28(ADDR7) U19.29(VCC) U19.43(VCC) U20.14(VCC) U20.20(ADDR3) U20.28(ADDR7) U20.29(VCC) U20.43(VCC) U21.14(VCC) U21.23(ADDR4) U21.28(ADDR7) U21.29(VCC) U21.43(VCC) U22.14(VCC) U22.20(ADDR3) U22.23(ADDR4) U22.28(ADDR7) U22.29(VCC) U22.43(VCC) U23.14(VCC) U23.24(ADDR5) U23.28(ADDR7) U23.29(VCC) U23.43(VCC) U24.14(VCC) U24.20(ADDR3) U24.24(ADDR5) U24.28(ADDR7) U24.29(VCC) U24.43(VCC) U25.14(VCC) U25.23(ADDR4) U25.24(ADDR5) U25.28(ADDR7) U25.29(VCC) U25.43(VCC) U26.14(VCC) U26.20(ADDR3) U26.23(ADDR4) U26.24(ADDR5) U26.28(ADDR7) U26.29(VCC) U26.43(VCC)
GND: C284.2 C285.2 C286.1 C287.1 C288.2 C289.1 C290.2 C291.1 C292.2 C293.1 C294.2 C295.1 C296.1 C297.1 C298.1 C299.1 C300.1 C301.1 C302.1 C303.1 C304.1 C305.1 C306.1 C307.1 C308.1 C309.1 C310.1 C311.1 C312.1 C313.1 C314.1 C315.1 C316.1 C317.1 C318.1 C319.1 C320.1 C321.1 C322.1 C323.1 C324.1 C325.1 C326.1 C327.1 C328.1 C329.1 C330.1 C331.1 C332.1 C333.1 C334.1 C335.1 C336.1 C337.1 C338.1 C339.1 C340.1 C341.1 C342.1 C343.1 C344.1 C345.1 C346.1 C347.1 C348.1 C349.1 C350.1 C351.1 C352.2 C353.1 C354.2 C355.1 C356.2 C357.1 C358.2 C359.1 C360.1 C361.1 C362.1 C363.1 C364.1 C365.1 C366.1 C367.1 C368.1 C369.1 C370.1 C371.1 C372.1 C373.1 C374.1 C375.1 C376.1 C377.1 C378.1 C379.1 C380.1 C381.1 C382.1 C383.1 C384.1 C385.1 C386.1 C387.1 C388.1 C389.1 C390.1 C391.1 C392.1 C393.1 C394.1 C395.1 C396.1 C397.1 C398.1 C399.1 C400.1 C401.1 C402.1 C403.1 C404.1 C405.1 C406.1 C407.1 C408.1 C409.1 C410.1 C411.1 C412.1 C413.1 C414.1 C415.1 M14.0(PIN) M15.0(PIN) M16.0(PIN) M17.0(PIN) M18.0(PIN) U19.3(GND) U19.8(GND) U19.12(GND) U19.13(VSS) U19.15(ADDR0) U19.16(ADDR1) U19.18(GND) U19.19(ADDR2) U19.20(ADDR3) U19.22(GND) U19.23(ADDR4) U19.24(ADDR5) U19.26(GND) U19.27(ADDR6) U19.30(VSS) U19.31(GND) U19.35(GND) U19.41(GND) U19.42(VSS) U19.45(SMODE) U19.46(GND) U19.50(TEST) U19.52(GND) U19.53(PLL_DVSS) U19.56(PLL_AVSS) U19.57(GND) U20.3(GND) U20.8(GND) U20.12(GND) U20.13(VSS) U20.15(ADDR0) U20.16(ADDR1) U20.18(GND) U20.19(ADDR2) U20.22(GND) U20.23(ADDR4) U20.24(ADDR5) U20.26(GND) U20.27(ADDR6) U20.30(VSS) U20.31(GND) U20.35(GND) U20.41(GND) U20.42(VSS) U20.45(SMODE) U20.46(GND) U20.50(TEST) U20.52(GND) U20.53(PLL_DVSS) U20.56(PLL_AVSS) U20.57(GND) U21.3(GND) U21.8(GND) U21.12(GND) U21.13(VSS) U21.15(ADDR0) U21.16(ADDR1) U21.18(GND) U21.19(ADDR2) U21.20(ADDR3) U21.22(GND) U21.24(ADDR5) U21.26(GND) U21.27(ADDR6) U21.30(VSS) U21.31(GND) U21.35(GND) U21.41(GND) U21.42(VSS) U21.45(SMODE) U21.46(GND) U21.50(TEST) U21.52(GND) U21.53(PLL_DVSS) U21.56(PLL_AVSS) U21.57(GND) U22.3(GND) U22.8(GND) U22.12(GND) U22.13(VSS) U22.15(ADDR0) U22.16(ADDR1) U22.18(GND) U22.19(ADDR2) U22.22(GND) U22.24(ADDR5) U22.26(GND) U22.27(ADDR6) U22.30(VSS) U22.31(GND) U22.35(GND) U22.41(GND) U22.42(VSS) U22.45(SMODE) U22.46(GND) U22.50(TEST) U22.52(GND) U22.53(PLL_DVSS) U22.56(PLL_AVSS) U22.57(GND) U23.3(GND) U23.8(GND) U23.12(GND) U23.13(VSS) U23.15(ADDR0) U23.16(ADDR1) U23.18(GND) U23.19(ADDR2) U23.20(ADDR3) U23.22(GND) U23.23(ADDR4) U23.26(GND) U23.27(ADDR6) U23.30(VSS) U23.31(GND) U23.35(GND) U23.41(GND) U23.42(VSS) U23.45(SMODE) U23.46(GND) U23.50(TEST) U23.52(GND) U23.53(PLL_DVSS) U23.56(PLL_AVSS) U23.57(GND) U24.3(GND) U24.8(GND) U24.12(GND) U24.13(VSS) U24.15(ADDR0) U24.16(ADDR1) U24.18(GND) U24.19(ADDR2) U24.22(GND) U24.23(ADDR4) U24.26(GND) U24.27(ADDR6) U24.30(VSS) U24.31(GND) U24.35(GND) U24.41(GND) U24.42(VSS) U24.45(SMODE) U24.46(GND) U24.50(TEST) U24.52(GND) U24.53(PLL_DVSS) U24.56(PLL_AVSS) U24.57(GND) U25.3(GND) U25.8(GND) U25.12(GND) U25.13(VSS) U25.15(ADDR0) U25.16(ADDR1) U25.18(GND) U25.19(ADDR2) U25.20(ADDR3) U25.22(GND) U25.26(GND) U25.27(ADDR6) U25.30(VSS) U25.31(GND) U25.35(GND) U25.41(GND) U25.42(VSS) U25.45(SMODE) U25.46(GND) U25.50(TEST) U25.52(GND) U25.53(PLL_DVSS) U25.56(PLL_AVSS) U25.57(GND) U26.3(GND) U26.8(GND) U26.12(GND) U26.13(VSS) U26.15(ADDR0) U26.16(ADDR1) U26.18(GND) U26.19(ADDR2) U26.22(GND) U26.26(GND) U26.27(ADDR6) U26.30(VSS) U26.31(GND) U26.35(GND) U26.41(GND) U26.42(VSS) U26.45(SMODE) U26.46(GND) U26.50(TEST) U26.52(GND) U26.53(PLL_DVSS) U26.56(PLL_AVSS) U26.57(GND)
VDD3: C284.1 C285.1 C286.2 C287.2 C308.2 C309.2 C310.2 C311.2 C312.2 C313.2 C314.2 C315.2 C316.2 C317.2 C318.2 C319.2 C320.2 C321.2 C322.2 C323.2 C324.2 C325.2 C326.2 C327.2 C328.2 C329.2 C330.2 C331.2 C332.2 C333.2 C334.2 C335.2 C336.2 C337.2 C338.2 C339.2 C340.2 C341.2 C342.2 C343.2 C344.2 C345.2 C346.2 C347.2 C348.2 C349.2 C350.2 C351.2 C372.2 C373.2 C374.2 C375.2 C376.2 C377.2 C378.2 C379.2 C380.2 C381.2 C382.2 C383.2 C384.2 C385.2 C386.2 C387.2 C388.2 C389.2 C390.2 C391.2 C392.2 C393.2 C394.2 C395.2 C396.2 C397.2 C398.2 C399.2 C400.2 C401.2 C402.2 C403.2 C404.2 C405.2 C406.2 C407.2 C408.2 C409.2 C410.2 C411.2 C412.2 C413.2 C414.2 C415.2 U19.4(VDD) U19.7(VDD) U19.11(VDD) U19.17(VDD) U19.21(VDD) U19.25(VDD) U19.32(VDD) U19.36(VDD) U19.40(VDD) U19.47(VDD) U19.51(VDD) U20.4(VDD) U20.7(VDD) U20.11(VDD) U20.17(VDD) U20.21(VDD) U20.25(VDD) U20.32(VDD) U20.36(VDD) U20.40(VDD) U20.47(VDD) U20.51(VDD) U21.4(VDD) U21.7(VDD) U21.11(VDD) U21.17(VDD) U21.21(VDD) U21.25(VDD) U21.32(VDD) U21.36(VDD) U21.40(VDD) U21.47(VDD) U21.51(VDD) U22.4(VDD) U22.7(VDD) U22.11(VDD) U22.17(VDD) U22.21(VDD) U22.25(VDD) U22.32(VDD) U22.36(VDD) U22.40(VDD) U22.47(VDD) U22.51(VDD) U23.4(VDD) U23.7(VDD) U23.11(VDD) U23.17(VDD) U23.21(VDD) U23.25(VDD) U23.32(VDD) U23.36(VDD) U23.40(VDD) U23.47(VDD) U23.51(VDD) U24.4(VDD) U24.7(VDD) U24.11(VDD) U24.17(VDD) U24.21(VDD) U24.25(VDD) U24.32(VDD) U24.36(VDD) U24.40(VDD) U24.47(VDD) U24.51(VDD) U25.4(VDD) U25.7(VDD) U25.11(VDD) U25.17(VDD) U25.21(VDD) U25.25(VDD) U25.32(VDD) U25.36(VDD) U25.40(VDD) U25.47(VDD) U25.51(VDD) U26.4(VDD) U26.7(VDD) U26.11(VDD) U26.17(VDD) U26.21(VDD) U26.25(VDD) U26.32(VDD) U26.36(VDD) U26.40(VDD) U26.47(VDD) U26.51(VDD)
VPLL3: C288.1 C290.1 C292.1 C294.1 C352.1 C354.1 C356.1 C358.1 FB17.2 FB18.2 FB19.2 FB20.2 FB21.2 FB22.2 FB23.2 FB24.2 U19.54(PLL_DVDD) U20.54(PLL_DVDD) U21.54(PLL_DVDD) U22.54(PLL_DVDD) U23.54(PLL_DVDD) U24.54(PLL_DVDD) U25.54(PLL_DVDD) U26.54(PLL_DVDD)
BO16: U19.9(BI)
BO17: TP89.1 U19.34(BO) U20.9(BI)
BO18: TP90.1 U20.34(BO) U21.9(BI)
BO19: TP91.1 U21.34(BO) U22.9(BI)
BO20: TP92.1 U22.34(BO) U23.9(BI)
BO21: TP109.1 U23.34(BO) U24.9(BI)
BO22: TP110.1 U24.34(BO) U25.9(BI)
BO23: TP111.1 U25.34(BO) U26.9(BI)
BO24: TP112.1 U26.34(BO)
CLK16: U19.1(XIN)
CLK17: TP102.1 U19.39(CLKOUT) U20.1(XIN)
CLK18: TP104.1 U20.39(CLKOUT) U21.1(XIN)
CLK19: TP106.1 U21.39(CLKOUT) U22.1(XIN)
CLK20: TP108.1 U22.39(CLKOUT) U23.1(XIN)
CLK21: TP122.1 U23.39(CLKOUT) U24.1(XIN)
CLK22: TP124.1 U24.39(CLKOUT) U25.1(XIN)
CLK23: TP126.1 U25.39(CLKOUT) U26.1(XIN)
CLK24: TP128.1 U26.39(CLKOUT)
CO16: U19.5(CI)
CO17: TP93.1 U19.38(CO) U20.5(CI)
CO18: TP95.1 U20.38(CO) U21.5(CI)
CO19: TP97.1 U21.38(CO) U22.5(CI)
CO20: TP99.1 U22.38(CO) U23.5(CI)
CO21: TP113.1 U23.38(CO) U24.5(CI)
CO22: TP115.1 U24.38(CO) U25.5(CI)
CO23: TP117.1 U25.38(CO) U26.5(CI)
CO24: TP119.1 U26.38(CO)
RI16: U19.6(RO)
RI17: TP94.1 U19.37(RI) U20.6(RO)
RI18: TP96.1 U20.37(RI) U21.6(RO)
RI19: TP98.1 U21.37(RI) U22.6(RO)
RI20: TP100.1 U22.37(RI) U23.6(RO)
RI21: TP114.1 U23.37(RI) U24.6(RO)
RI22: TP116.1 U24.37(RI) U25.6(RO)
RI23: TP118.1 U25.37(RI) U26.6(RO)
RI24: TP120.1 U26.37(RI)
RST16: U19.10(RST_N)
RST17: TP101.1 U19.33(NRSTO) U20.10(RST_N)
RST18: TP103.1 U20.33(NRSTO) U21.10(RST_N)
RST19: TP105.1 U21.33(NRSTO) U22.10(RST_N)
RST20: TP107.1 U22.33(NRSTO) U23.10(RST_N)
RST21: TP121.1 U23.33(NRSTO) U24.10(RST_N)
RST22: TP123.1 U24.33(NRSTO) U25.10(RST_N)
RST23: TP125.1 U25.33(NRSTO) U26.10(RST_N)
RST24: TP127.1 U26.33(NRSTO)
NetC289_2: C289.2 FB17.1 U19.55(PLL_AVDD)
NetC291_2: C291.2 FB18.1 U20.55(PLL_AVDD)
NetC293_2: C293.2 FB19.1 U21.55(PLL_AVDD)
NetC295_2: C295.2 FB20.1 U22.55(PLL_AVDD)
NetC353_2: C353.2 FB21.1 U23.55(PLL_AVDD)
NetC355_2: C355.2 FB22.1 U24.55(PLL_AVDD)
NetC357_2: C357.2 FB23.1 U25.55(PLL_AVDD)
NetC359_2: C359.2 FB24.1 U26.55(PLL_AVDD)

Not connected (* = marked no-connect by the designer): U19 2(XOUT)* 44(CMODE)* 48(TF)* 49(RF)*; U20 2(XOUT)* 44(CMODE)* 48(TF)* 49(RF)*; U21 2(XOUT)* 44(CMODE)* 48(TF)* 49(RF)*; U22 2(XOUT)* 44(CMODE)* 48(TF)* 49(RF)*; U23 2(XOUT)* 44(CMODE)* 48(TF)* 49(RF)*; U24 2(XOUT)* 44(CMODE)* 48(TF)* 49(RF)*; U25 2(XOUT)* 44(CMODE)* 48(TF)* 49(RF)*; U26 2(XOUT)* 44(CMODE)* 48(TF)* 49(RF)*

### Notes on the sheet
- ADDR:0x80
- ADDR:0x88
- ADDR:0x90
- ADDR:0x98
- ADDR:0xA0
- ADDR:0xA8
- ADDR:0xB0
- ADDR:0xB8

### Library data of the parts
C284 C285 = T492C: Solid Tantalum Chip Capacitor, T492 Series - CWR11 Style Per Mil-PRF-55365/8; Published: 17-Jul-2002; LatestRevisionDate: 19-Mar-2004; LatestRevisionNote: Silkscreen dimensions re-sized.; DatasheetDocument: Mar-2001; PackageDocument: Mar-2001; PackageReference: C; Publisher: Altium Limited; Code_JEITA: 6032-28; ComponentLink1Description: Manufacturer Link; ComponentLink1URL: http://www.kemet.com/; ComponentLink2Description: Datasheet; ComponentLink2URL: http://www.kemet.com/kemet/web/homepage/kechome.nsf/vapubfilesname/F3102TA.pdf/$file/F3102TA.pdf; Value: 680uF/6.3V
C286 C287 = Cap Semi: Capacitor (Semiconductor SIM Model); Published: 8-Jun-2000; LatestRevisionDate: 29-May-2009; LatestRevisionNote: IPC-7351 Footprint Added.; PackageReference: C1206; Publisher: Altium Limited; PackageDescription: Chip Capacitor; Value: 100nF
C288-C415 = Cap: Capacitor; Published: 8-Jun-2000; LatestRevisionDate: 17-Jul-2002; LatestRevisionNote: Re-released for DXP Platform.; PackageReference: RAD-0.3; Publisher: Altium Limited; PackageDescription: Radial Cap, Thru-Hole; 2 Leads; 0.3 in Pin Spacing; Value: 100nF
FB17-FB24 = FB: Inductor; Code_IEC: 1005; Published: 8-Jun-2000; LatestRevisionDate: 29-May-2009; LatestRevisionNote: IPC-7351 Footprint Added.; PackageReference: 0402-A; Publisher: Altium Limited; PackageDescription: Chip Inductor; Code_JEITA: 0402; Value: 600/100M
M14-M18 = M_Hole
TP89-TP128 = TP: Test Point
  TP89 TP91-TP94 TP97-TP102 TP105-TP128: Value: TP

## Sheet HashUnit4.SchDoc: ANT_Miner_V1.3
size A2; Date: 2013/11/20; DrawnBy: Bitmain Technology; SheetNumber: 9; SheetTotal: 9
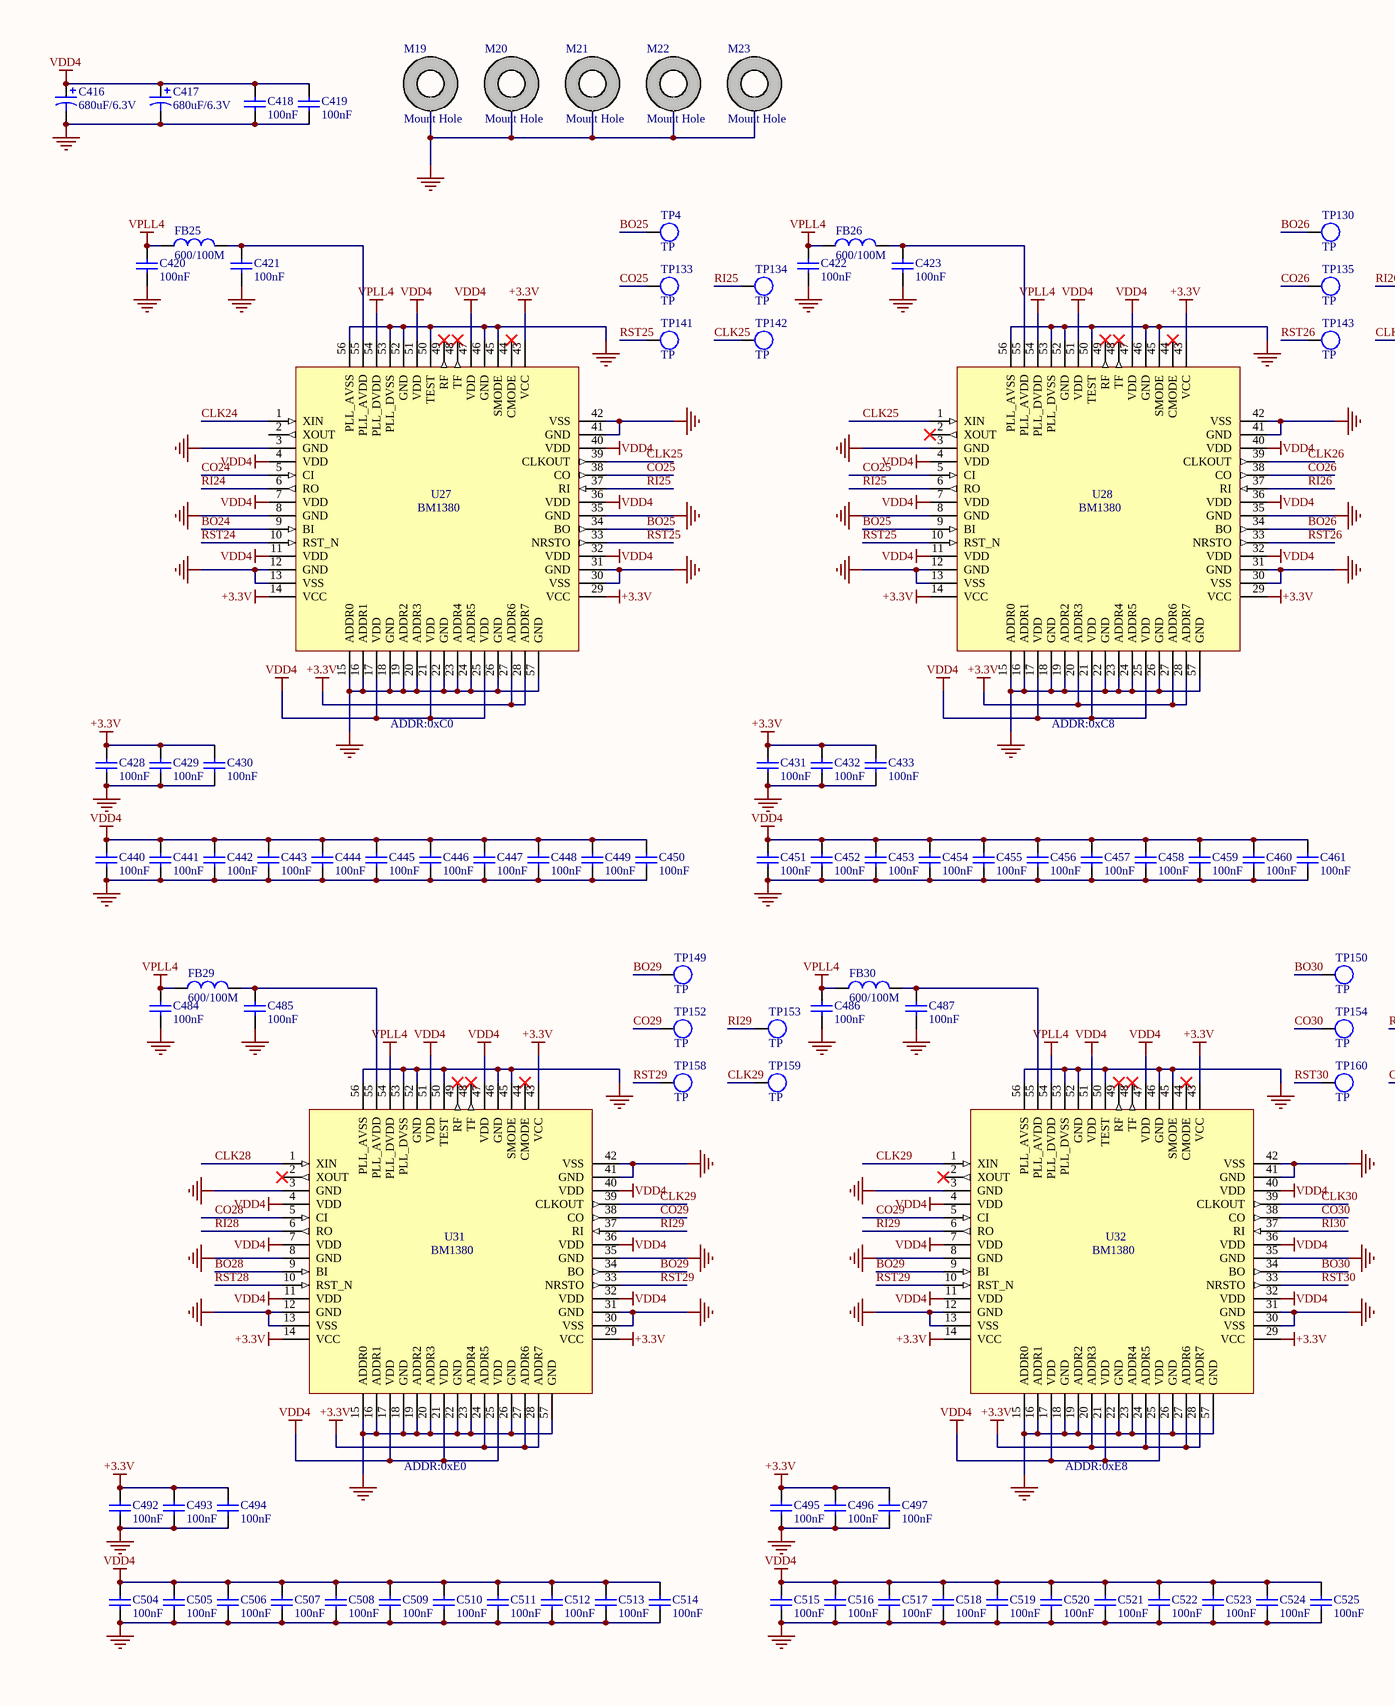
[diagram p11: HashUnit4.SchDoc, left]
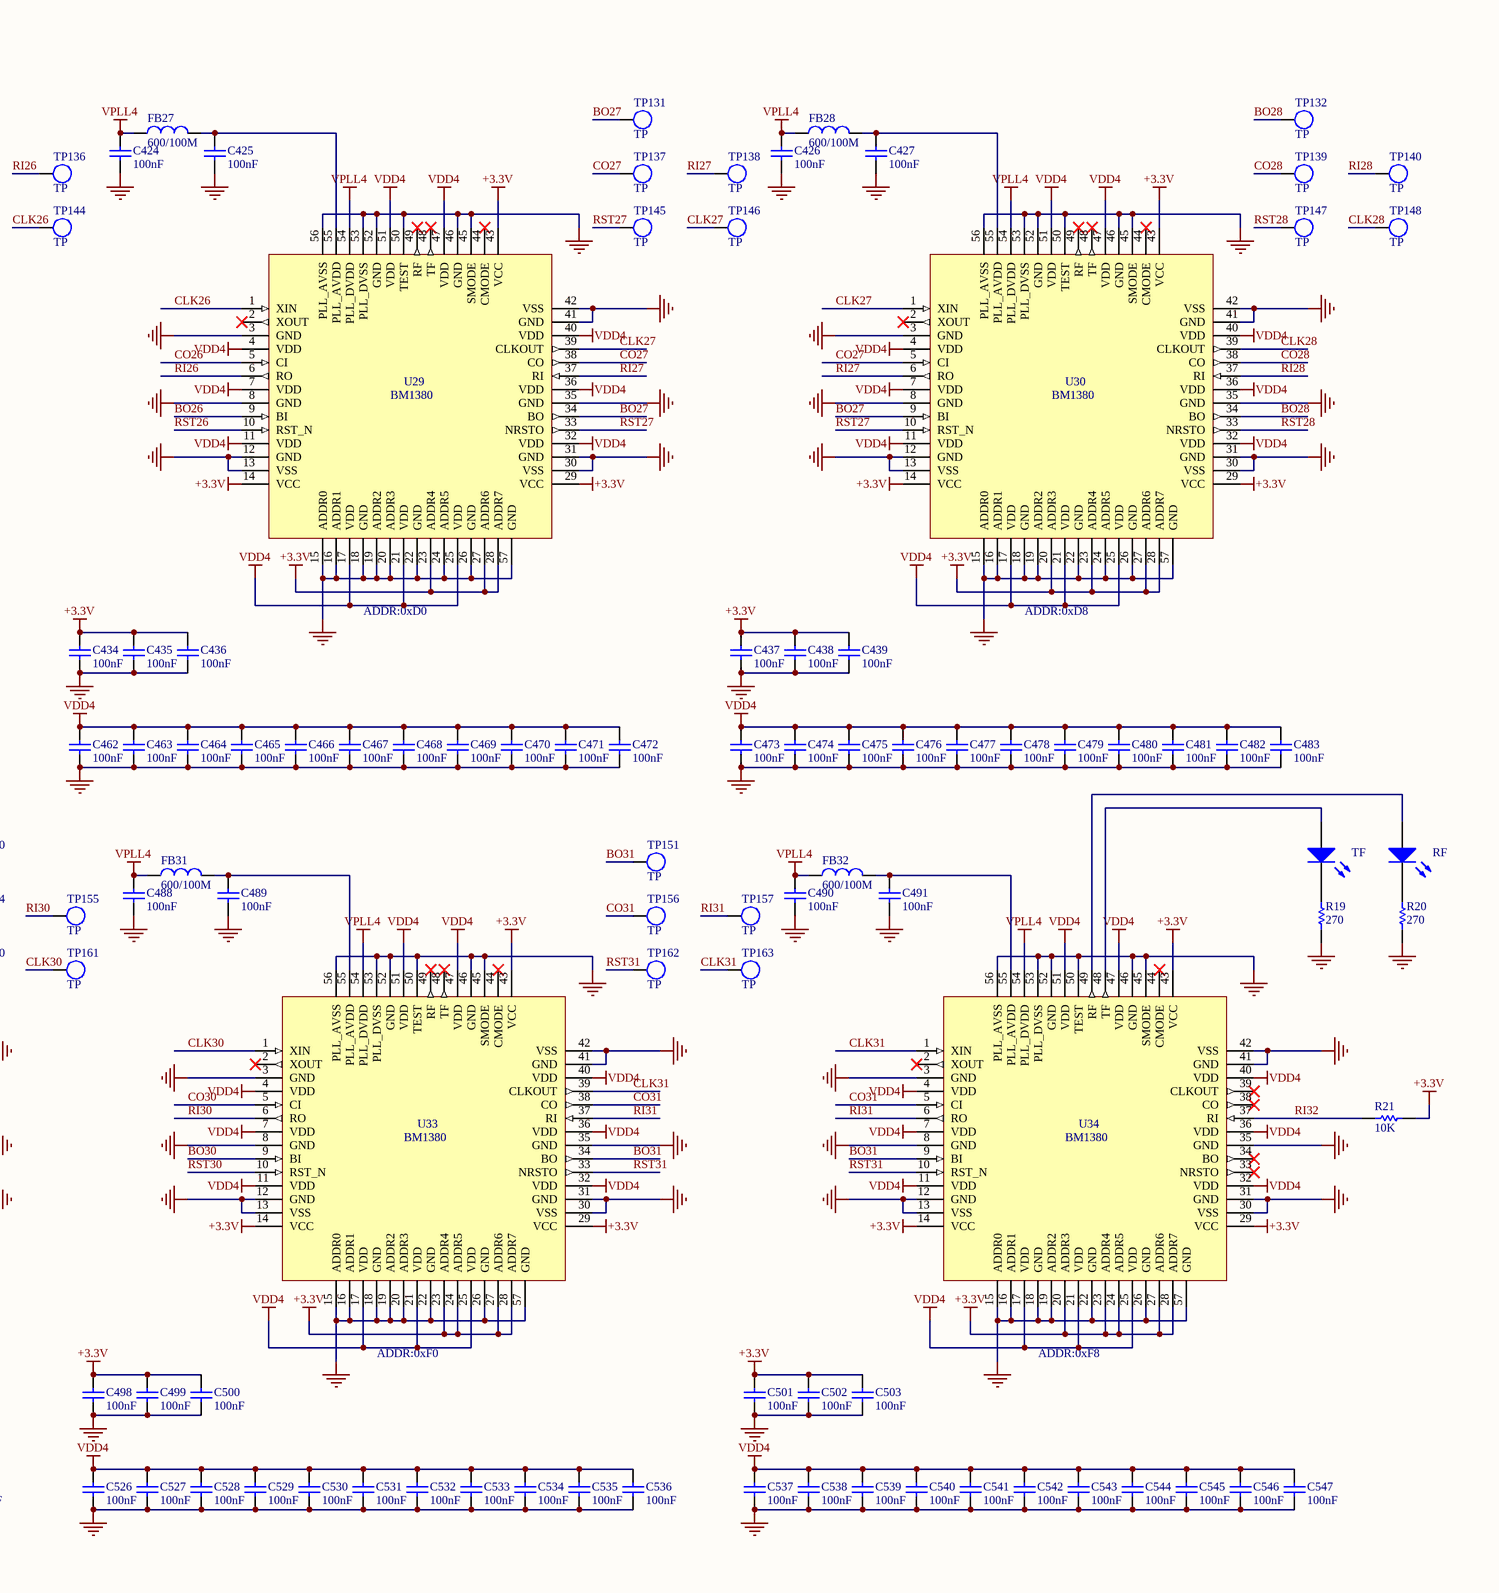
[diagram p12: HashUnit4.SchDoc, right]

### Parts
C416  680uF/6.3V  [D]
C417  680uF/6.3V  [D]
C418  100nF  [CC0603(1608)]
C419  100nF  [CC0603(1608)]
C420  100nF  [CC0603(1608)]
C421  100nF  [CC0603(1608)]
C422  100nF  [CC0603(1608)]
C423  100nF  [CC0603(1608)]
C424  100nF  [CC0603(1608)]
C425  100nF  [CC0603(1608)]
C426  100nF  [CC0603(1608)]
C427  100nF  [CC0603(1608)]
C428  100nF  [CC0603(1608)]
C429  100nF  [CC0603(1608)]
C430  100nF  [CC0603(1608)]
C431  100nF  [CC0603(1608)]
C432  100nF  [CC0603(1608)]
C433  100nF  [CC0603(1608)]
C434  100nF  [CC0603(1608)]
C435  100nF  [CC0603(1608)]
C436  100nF  [CC0603(1608)]
C437  100nF  [CC0603(1608)]
C438  100nF  [CC0603(1608)]
C439  100nF  [CC0603(1608)]
C440  100nF  [CC0603(1608)]
C441  100nF  [CC0603(1608)]
C442  100nF  [CC0603(1608)]
C443  100nF  [CC0603(1608)]
C444  100nF  [CC0603(1608)]
C445  100nF  [CC0603(1608)]
C446  100nF  [CC0603(1608)]
C447  100nF  [CC0603(1608)]
C448  100nF  [CC0603(1608)]
C449  100nF  [CC0603(1608)]
C450  100nF  [CC0603(1608)]
C451  100nF  [CC0603(1608)]
C452  100nF  [CC0603(1608)]
C453  100nF  [CC0603(1608)]
C454  100nF  [CC0603(1608)]
C455  100nF  [CC0603(1608)]
C456  100nF  [CC0603(1608)]
C457  100nF  [CC0603(1608)]
C458  100nF  [CC0603(1608)]
C459  100nF  [CC0603(1608)]
C460  100nF  [CC0603(1608)]
C461  100nF  [CC0603(1608)]
C462  100nF  [CC0603(1608)]
C463  100nF  [CC0603(1608)]
C464  100nF  [CC0603(1608)]
C465  100nF  [CC0603(1608)]
C466  100nF  [CC0603(1608)]
C467  100nF  [CC0603(1608)]
C468  100nF  [CC0603(1608)]
C469  100nF  [CC0603(1608)]
C470  100nF  [CC0603(1608)]
C471  100nF  [CC0603(1608)]
C472  100nF  [CC0603(1608)]
C473  100nF  [CC0603(1608)]
C474  100nF  [CC0603(1608)]
C475  100nF  [CC0603(1608)]
C476  100nF  [CC0603(1608)]
C477  100nF  [CC0603(1608)]
C478  100nF  [CC0603(1608)]
C479  100nF  [CC0603(1608)]
C480  100nF  [CC0603(1608)]
C481  100nF  [CC0603(1608)]
C482  100nF  [CC0603(1608)]
C483  100nF  [CC0603(1608)]
C484  100nF  [CC0603(1608)]
C485  100nF  [CC0603(1608)]
C486  100nF  [CC0603(1608)]
C487  100nF  [CC0603(1608)]
C488  100nF  [CC0603(1608)]
C489  100nF  [CC0603(1608)]
C490  100nF  [CC0603(1608)]
C491  100nF  [CC0603(1608)]
C492  100nF  [CC0603(1608)]
C493  100nF  [CC0603(1608)]
C494  100nF  [CC0603(1608)]
C495  100nF  [CC0603(1608)]
C496  100nF  [CC0603(1608)]
C497  100nF  [CC0603(1608)]
C498  100nF  [CC0603(1608)]
C499  100nF  [CC0603(1608)]
C500  100nF  [CC0603(1608)]
C501  100nF  [CC0603(1608)]
C502  100nF  [CC0603(1608)]
C503  100nF  [CC0603(1608)]
C504  100nF  [CC0603(1608)]
C505  100nF  [CC0603(1608)]
C506  100nF  [CC0603(1608)]
C507  100nF  [CC0603(1608)]
C508  100nF  [CC0603(1608)]
C509  100nF  [CC0603(1608)]
C510  100nF  [CC0603(1608)]
C511  100nF  [CC0603(1608)]
C512  100nF  [CC0603(1608)]
C513  100nF  [CC0603(1608)]
C514  100nF  [CC0603(1608)]
C515  100nF  [CC0603(1608)]
C516  100nF  [CC0603(1608)]
C517  100nF  [CC0603(1608)]
C518  100nF  [CC0603(1608)]
C519  100nF  [CC0603(1608)]
C520  100nF  [CC0603(1608)]
C521  100nF  [CC0603(1608)]
C522  100nF  [CC0603(1608)]
C523  100nF  [CC0603(1608)]
C524  100nF  [CC0603(1608)]
C525  100nF  [CC0603(1608)]
C526  100nF  [CC0603(1608)]
C527  100nF  [CC0603(1608)]
C528  100nF  [CC0603(1608)]
C529  100nF  [CC0603(1608)]
C530  100nF  [CC0603(1608)]
C531  100nF  [CC0603(1608)]
C532  100nF  [CC0603(1608)]
C533  100nF  [CC0603(1608)]
C534  100nF  [CC0603(1608)]
C535  100nF  [CC0603(1608)]
C536  100nF  [CC0603(1608)]
C537  100nF  [CC0603(1608)]
C538  100nF  [CC0603(1608)]
C539  100nF  [CC0603(1608)]
C540  100nF  [CC0603(1608)]
C541  100nF  [CC0603(1608)]
C542  100nF  [CC0603(1608)]
C543  100nF  [CC0603(1608)]
C544  100nF  [CC0603(1608)]
C545  100nF  [CC0603(1608)]
C546  100nF  [CC0603(1608)]
C547  100nF  [CC0603(1608)]
FB25  600/100M  [FB0603(1608)]
FB26  600/100M  [FB0603(1608)]
FB27  600/100M  [FB0603(1608)]
FB28  600/100M  [FB0603(1608)]
FB29  600/100M  [FB0603(1608)]
FB30  600/100M  [FB0603(1608)]
FB31  600/100M  [FB0603(1608)]
FB32  600/100M  [FB0603(1608)]
M19  Mount Hole  [MHOLE2]
M20  Mount Hole  [MHOLE2]
M21  Mount Hole  [MHOLE2]
M22  Mount Hole  [MHOLE2]
M23  Mount Hole  [MHOLE2]
R19  270  [RR0603(1608)]
R20  270  [RR0603(1608)]
R21  10K  [RR0603(1608)]
RF  Green  [LED0603(1608)]  (value not drawn)
TF  Green  [LED0603(1608)]  (value not drawn)
TP4  TP  [TP_SMD]
TP130  TP  [TP_SMD]
TP131  TP  [TP_SMD]
TP132  TP  [TP_SMD]
TP133  TP  [TP_SMD]
TP134  TP  [TP_SMD]
TP135  TP  [TP_SMD]
TP136  TP  [TP_SMD]
TP137  TP  [TP_SMD]
TP138  TP  [TP_SMD]
TP139  TP  [TP_SMD]
TP140  TP  [TP_SMD]
TP141  TP  [TP_SMD]
TP142  TP  [TP_SMD]
TP143  TP  [TP_SMD]
TP144  TP  [TP_SMD]
TP145  TP  [TP_SMD]
TP146  TP  [TP_SMD]
TP147  TP  [TP_SMD]
TP148  TP  [TP_SMD]
TP149  TP  [TP_SMD]
TP150  TP  [TP_SMD]
TP151  TP  [TP_SMD]
TP152  TP  [TP_SMD]
TP153  TP  [TP_SMD]
TP154  TP  [TP_SMD]
TP155  TP  [TP_SMD]
TP156  TP  [TP_SMD]
TP157  TP  [TP_SMD]
TP158  TP  [TP_SMD]
TP159  TP  [TP_SMD]
TP160  TP  [TP_SMD]
TP161  TP  [TP_SMD]
TP162  TP  [TP_SMD]
TP163  TP  [TP_SMD]
U27  BM1380  [QFN56]
U28  BM1380  [QFN56]
U29  BM1380  [QFN56]
U30  BM1380  [QFN56]
U31  BM1380  [QFN56]
U32  BM1380  [QFN56]
U33  BM1380  [QFN56]
U34  BM1380  [QFN56]

### Nets
+3.3V: C428.2 C429.2 C430.2 C431.2 C432.2 C433.2 C434.2 C435.2 C436.2 C437.2 C438.2 C439.2 C492.2 C493.2 C494.2 C495.2 C496.2 C497.2 C498.2 C499.2 C500.2 C501.2 C502.2 C503.2 R21.2 U27.14(VCC) U27.27(ADDR6) U27.28(ADDR7) U27.29(VCC) U27.43(VCC) U28.14(VCC) U28.20(ADDR3) U28.27(ADDR6) U28.28(ADDR7) U28.29(VCC) U28.43(VCC) U29.14(VCC) U29.23(ADDR4) U29.27(ADDR6) U29.28(ADDR7) U29.29(VCC) U29.43(VCC) U30.14(VCC) U30.20(ADDR3) U30.23(ADDR4) U30.27(ADDR6) U30.28(ADDR7) U30.29(VCC) U30.43(VCC) U31.14(VCC) U31.24(ADDR5) U31.27(ADDR6) U31.28(ADDR7) U31.29(VCC) U31.43(VCC) U32.14(VCC) U32.20(ADDR3) U32.24(ADDR5) U32.27(ADDR6) U32.28(ADDR7) U32.29(VCC) U32.43(VCC) U33.14(VCC) U33.23(ADDR4) U33.24(ADDR5) U33.27(ADDR6) U33.28(ADDR7) U33.29(VCC) U33.43(VCC) U34.14(VCC) U34.20(ADDR3) U34.23(ADDR4) U34.24(ADDR5) U34.27(ADDR6) U34.28(ADDR7) U34.29(VCC) U34.43(VCC)
GND: C416.2 C417.2 C418.1 C419.1 C420.2 C421.1 C422.2 C423.1 C424.2 C425.1 C426.2 C427.1 C428.1 C429.1 C430.1 C431.1 C432.1 C433.1 C434.1 C435.1 C436.1 C437.1 C438.1 C439.1 C440.1 C441.1 C442.1 C443.1 C444.1 C445.1 C446.1 C447.1 C448.1 C449.1 C450.1 C451.1 C452.1 C453.1 C454.1 C455.1 C456.1 C457.1 C458.1 C459.1 C460.1 C461.1 C462.1 C463.1 C464.1 C465.1 C466.1 C467.1 C468.1 C469.1 C470.1 C471.1 C472.1 C473.1 C474.1 C475.1 C476.1 C477.1 C478.1 C479.1 C480.1 C481.1 C482.1 C483.1 C484.2 C485.1 C486.2 C487.1 C488.2 C489.1 C490.2 C491.1 C492.1 C493.1 C494.1 C495.1 C496.1 C497.1 C498.1 C499.1 C500.1 C501.1 C502.1 C503.1 C504.1 C505.1 C506.1 C507.1 C508.1 C509.1 C510.1 C511.1 C512.1 C513.1 C514.1 C515.1 C516.1 C517.1 C518.1 C519.1 C520.1 C521.1 C522.1 C523.1 C524.1 C525.1 C526.1 C527.1 C528.1 C529.1 C530.1 C531.1 C532.1 C533.1 C534.1 C535.1 C536.1 C537.1 C538.1 C539.1 C540.1 C541.1 C542.1 C543.1 C544.1 C545.1 C546.1 C547.1 M19.0(PIN) M20.0(PIN) M21.0(PIN) M22.0(PIN) M23.0(PIN) R19.1 R20.1 U27.3(GND) U27.8(GND) U27.12(GND) U27.13(VSS) U27.15(ADDR0) U27.16(ADDR1) U27.18(GND) U27.19(ADDR2) U27.20(ADDR3) U27.22(GND) U27.23(ADDR4) U27.24(ADDR5) U27.26(GND) U27.30(VSS) U27.31(GND) U27.35(GND) U27.41(GND) U27.42(VSS) U27.45(SMODE) U27.46(GND) U27.50(TEST) U27.52(GND) U27.53(PLL_DVSS) U27.56(PLL_AVSS) U27.57(GND) U28.3(GND) U28.8(GND) U28.12(GND) U28.13(VSS) U28.15(ADDR0) U28.16(ADDR1) U28.18(GND) U28.19(ADDR2) U28.22(GND) U28.23(ADDR4) U28.24(ADDR5) U28.26(GND) U28.30(VSS) U28.31(GND) U28.35(GND) U28.41(GND) U28.42(VSS) U28.45(SMODE) U28.46(GND) U28.50(TEST) U28.52(GND) U28.53(PLL_DVSS) U28.56(PLL_AVSS) U28.57(GND) U29.3(GND) U29.8(GND) U29.12(GND) U29.13(VSS) U29.15(ADDR0) U29.16(ADDR1) U29.18(GND) U29.19(ADDR2) U29.20(ADDR3) U29.22(GND) U29.24(ADDR5) U29.26(GND) U29.30(VSS) U29.31(GND) U29.35(GND) U29.41(GND) U29.42(VSS) U29.45(SMODE) U29.46(GND) U29.50(TEST) U29.52(GND) U29.53(PLL_DVSS) U29.56(PLL_AVSS) U29.57(GND) U30.3(GND) U30.8(GND) U30.12(GND) U30.13(VSS) U30.15(ADDR0) U30.16(ADDR1) U30.18(GND) U30.19(ADDR2) U30.22(GND) U30.24(ADDR5) U30.26(GND) U30.30(VSS) U30.31(GND) U30.35(GND) U30.41(GND) U30.42(VSS) U30.45(SMODE) U30.46(GND) U30.50(TEST) U30.52(GND) U30.53(PLL_DVSS) U30.56(PLL_AVSS) U30.57(GND) U31.3(GND) U31.8(GND) U31.12(GND) U31.13(VSS) U31.15(ADDR0) U31.16(ADDR1) U31.18(GND) U31.19(ADDR2) U31.20(ADDR3) U31.22(GND) U31.23(ADDR4) U31.26(GND) U31.30(VSS) U31.31(GND) U31.35(GND) U31.41(GND) U31.42(VSS) U31.45(SMODE) U31.46(GND) U31.50(TEST) U31.52(GND) U31.53(PLL_DVSS) U31.56(PLL_AVSS) U31.57(GND) U32.3(GND) U32.8(GND) U32.12(GND) U32.13(VSS) U32.15(ADDR0) U32.16(ADDR1) U32.18(GND) U32.19(ADDR2) U32.22(GND) U32.23(ADDR4) U32.26(GND) U32.30(VSS) U32.31(GND) U32.35(GND) U32.41(GND) U32.42(VSS) U32.45(SMODE) U32.46(GND) U32.50(TEST) U32.52(GND) U32.53(PLL_DVSS) U32.56(PLL_AVSS) U32.57(GND) U33.3(GND) U33.8(GND) U33.12(GND) U33.13(VSS) U33.15(ADDR0) U33.16(ADDR1) U33.18(GND) U33.19(ADDR2) U33.20(ADDR3) U33.22(GND) U33.26(GND) U33.30(VSS) U33.31(GND) U33.35(GND) U33.41(GND) U33.42(VSS) U33.45(SMODE) U33.46(GND) U33.50(TEST) U33.52(GND) U33.53(PLL_DVSS) U33.56(PLL_AVSS) U33.57(GND) U34.3(GND) U34.8(GND) U34.12(GND) U34.13(VSS) U34.15(ADDR0) U34.16(ADDR1) U34.18(GND) U34.19(ADDR2) U34.22(GND) U34.26(GND) U34.30(VSS) U34.31(GND) U34.35(GND) U34.41(GND) U34.42(VSS) U34.45(SMODE) U34.46(GND) U34.50(TEST) U34.52(GND) U34.53(PLL_DVSS) U34.56(PLL_AVSS) U34.57(GND)
VDD4: C416.1 C417.1 C418.2 C419.2 C440.2 C441.2 C442.2 C443.2 C444.2 C445.2 C446.2 C447.2 C448.2 C449.2 C450.2 C451.2 C452.2 C453.2 C454.2 C455.2 C456.2 C457.2 C458.2 C459.2 C460.2 C461.2 C462.2 C463.2 C464.2 C465.2 C466.2 C467.2 C468.2 C469.2 C470.2 C471.2 C472.2 C473.2 C474.2 C475.2 C476.2 C477.2 C478.2 C479.2 C480.2 C481.2 C482.2 C483.2 C504.2 C505.2 C506.2 C507.2 C508.2 C509.2 C510.2 C511.2 C512.2 C513.2 C514.2 C515.2 C516.2 C517.2 C518.2 C519.2 C520.2 C521.2 C522.2 C523.2 C524.2 C525.2 C526.2 C527.2 C528.2 C529.2 C530.2 C531.2 C532.2 C533.2 C534.2 C535.2 C536.2 C537.2 C538.2 C539.2 C540.2 C541.2 C542.2 C543.2 C544.2 C545.2 C546.2 C547.2 U27.4(VDD) U27.7(VDD) U27.11(VDD) U27.17(VDD) U27.21(VDD) U27.25(VDD) U27.32(VDD) U27.36(VDD) U27.40(VDD) U27.47(VDD) U27.51(VDD) U28.4(VDD) U28.7(VDD) U28.11(VDD) U28.17(VDD) U28.21(VDD) U28.25(VDD) U28.32(VDD) U28.36(VDD) U28.40(VDD) U28.47(VDD) U28.51(VDD) U29.4(VDD) U29.7(VDD) U29.11(VDD) U29.17(VDD) U29.21(VDD) U29.25(VDD) U29.32(VDD) U29.36(VDD) U29.40(VDD) U29.47(VDD) U29.51(VDD) U30.4(VDD) U30.7(VDD) U30.11(VDD) U30.17(VDD) U30.21(VDD) U30.25(VDD) U30.32(VDD) U30.36(VDD) U30.40(VDD) U30.47(VDD) U30.51(VDD) U31.4(VDD) U31.7(VDD) U31.11(VDD) U31.17(VDD) U31.21(VDD) U31.25(VDD) U31.32(VDD) U31.36(VDD) U31.40(VDD) U31.47(VDD) U31.51(VDD) U32.4(VDD) U32.7(VDD) U32.11(VDD) U32.17(VDD) U32.21(VDD) U32.25(VDD) U32.32(VDD) U32.36(VDD) U32.40(VDD) U32.47(VDD) U32.51(VDD) U33.4(VDD) U33.7(VDD) U33.11(VDD) U33.17(VDD) U33.21(VDD) U33.25(VDD) U33.32(VDD) U33.36(VDD) U33.40(VDD) U33.47(VDD) U33.51(VDD) U34.4(VDD) U34.7(VDD) U34.11(VDD) U34.17(VDD) U34.21(VDD) U34.25(VDD) U34.32(VDD) U34.36(VDD) U34.40(VDD) U34.47(VDD) U34.51(VDD)
VPLL4: C420.1 C422.1 C424.1 C426.1 C484.1 C486.1 C488.1 C490.1 FB25.2 FB26.2 FB27.2 FB28.2 FB29.2 FB30.2 FB31.2 FB32.2 U27.54(PLL_DVDD) U28.54(PLL_DVDD) U29.54(PLL_DVDD) U30.54(PLL_DVDD) U31.54(PLL_DVDD) U32.54(PLL_DVDD) U33.54(PLL_DVDD) U34.54(PLL_DVDD)
BO24: U27.9(BI)
BO25: TP4.1 U27.34(BO) U28.9(BI)
BO26: TP130.1 U28.34(BO) U29.9(BI)
BO27: TP131.1 U29.34(BO) U30.9(BI)
BO28: TP132.1 U30.34(BO) U31.9(BI)
BO29: TP149.1 U31.34(BO) U32.9(BI)
BO30: TP150.1 U32.34(BO) U33.9(BI)
BO31: TP151.1 U33.34(BO) U34.9(BI)
CLK24: U27.1(XIN)
CLK25: TP142.1 U27.39(CLKOUT) U28.1(XIN)
CLK26: TP144.1 U28.39(CLKOUT) U29.1(XIN)
CLK27: TP146.1 U29.39(CLKOUT) U30.1(XIN)
CLK28: TP148.1 U30.39(CLKOUT) U31.1(XIN)
CLK29: TP159.1 U31.39(CLKOUT) U32.1(XIN)
CLK30: TP161.1 U32.39(CLKOUT) U33.1(XIN)
CLK31: TP163.1 U33.39(CLKOUT) U34.1(XIN)
CO24: U27.5(CI)
CO25: TP133.1 U27.38(CO) U28.5(CI)
CO26: TP135.1 U28.38(CO) U29.5(CI)
CO27: TP137.1 U29.38(CO) U30.5(CI)
CO28: TP139.1 U30.38(CO) U31.5(CI)
CO29: TP152.1 U31.38(CO) U32.5(CI)
CO30: TP154.1 U32.38(CO) U33.5(CI)
CO31: TP156.1 U33.38(CO) U34.5(CI)
RI24: U27.6(RO)
RI25: TP134.1 U27.37(RI) U28.6(RO)
RI26: TP136.1 U28.37(RI) U29.6(RO)
RI27: TP138.1 U29.37(RI) U30.6(RO)
RI28: TP140.1 U30.37(RI) U31.6(RO)
RI29: TP153.1 U31.37(RI) U32.6(RO)
RI30: TP155.1 U32.37(RI) U33.6(RO)
RI31: TP157.1 U33.37(RI) U34.6(RO)
RI32: R21.1 U34.37(RI)
RST24: U27.10(RST_N)
RST25: TP141.1 U27.33(NRSTO) U28.10(RST_N)
RST26: TP143.1 U28.33(NRSTO) U29.10(RST_N)
RST27: TP145.1 U29.33(NRSTO) U30.10(RST_N)
RST28: TP147.1 U30.33(NRSTO) U31.10(RST_N)
RST29: TP158.1 U31.33(NRSTO) U32.10(RST_N)
RST30: TP160.1 U32.33(NRSTO) U33.10(RST_N)
RST31: TP162.1 U33.33(NRSTO) U34.10(RST_N)
NetC421_2: C421.2 FB25.1 U27.55(PLL_AVDD)
NetC423_2: C423.2 FB26.1 U28.55(PLL_AVDD)
NetC425_2: C425.2 FB27.1 U29.55(PLL_AVDD)
NetC427_2: C427.2 FB28.1 U30.55(PLL_AVDD)
NetC485_2: C485.2 FB29.1 U31.55(PLL_AVDD)
NetC487_2: C487.2 FB30.1 U32.55(PLL_AVDD)
NetC489_2: C489.2 FB31.1 U33.55(PLL_AVDD)
NetC491_2: C491.2 FB32.1 U34.55(PLL_AVDD)
NetR19_2: R19.2 TF.2(K)
NetR20_2: R20.2 RF.2(K)
NetRF_1: RF.1(A) U34.49(RF)
NetTF_1: TF.1(A) U34.48(TF)

Not connected (* = marked no-connect by the designer): U27 2(XOUT) 44(CMODE)* 48(TF)* 49(RF)*; U28 2(XOUT)* 44(CMODE)* 48(TF)* 49(RF)*; U29 2(XOUT)* 44(CMODE)* 48(TF)* 49(RF)*; U30 2(XOUT)* 44(CMODE)* 48(TF)* 49(RF)*; U31 2(XOUT)* 44(CMODE)* 48(TF)* 49(RF)*; U32 2(XOUT)* 44(CMODE)* 48(TF)* 49(RF)*; U33 2(XOUT)* 44(CMODE)* 48(TF)* 49(RF)*; U34 2(XOUT)* 33(NRSTO)* 34(BO)* 38(CO)* 39(CLKOUT)* 44(CMODE)*

### Notes on the sheet
- ADDR:0xC0
- ADDR:0xC8
- ADDR:0xD0
- ADDR:0xD8
- ADDR:0xE0
- ADDR:0xE8
- ADDR:0xF0
- ADDR:0xF8

### Library data of the parts
C416 C417 = T492C: as C284 on sheet HashUnit3; Published: 17-Jul-2002; LatestRevisionDate: 19-Mar-2004; LatestRevisionNote: Silkscreen dimensions re-sized.; DatasheetDocument: Mar-2001; PackageDocument: Mar-2001; PackageReference: C; Publisher: Altium Limited; Code_JEITA: 6032-28; ComponentLink1Description: Manufacturer Link; ComponentLink1URL: http://www.kemet.com/; ComponentLink2Description: Datasheet; ComponentLink2URL: http://www.kemet.com/kemet/web/homepage/kechome.nsf/vapubfilesname/F3102TA.pdf/$file/F3102TA.pdf; Value: 680uF/6.3V
C418 C419 = Cap Semi: Capacitor (Semiconductor SIM Model); Published: 8-Jun-2000; LatestRevisionDate: 29-May-2009; LatestRevisionNote: IPC-7351 Footprint Added.; PackageReference: C1206; Publisher: Altium Limited; PackageDescription: Chip Capacitor; Value: 100nF
C420-C547 = Cap: Capacitor; Published: 8-Jun-2000; LatestRevisionDate: 17-Jul-2002; LatestRevisionNote: Re-released for DXP Platform.; PackageReference: RAD-0.3; Publisher: Altium Limited; PackageDescription: Radial Cap, Thru-Hole; 2 Leads; 0.3 in Pin Spacing; Value: 100nF
FB25-FB32 = FB: Inductor; Code_IEC: 1005; Published: 8-Jun-2000; LatestRevisionDate: 29-May-2009; LatestRevisionNote: IPC-7351 Footprint Added.; PackageReference: 0402-A; Publisher: Altium Limited; PackageDescription: Chip Inductor; Code_JEITA: 0402; Value: 600/100M
M19-M23 = M_Hole
R19-R21 = Res1: Resistor
  R19 R20: Value: 270
  R21: Published: 8-Jun-2000; LatestRevisionDate: 17-Jul-2002; LatestRevisionNote: Re-released for DXP Platform.; PackageReference: AXIAL-0.3; Publisher: Altium Limited; PackageDescription: Axial Device, Thru-Hole; 2 Leads; 0.3 in Pin Spacing; Value: 10K
RF TF = LED0: Typical INFRARED GaAs LED; Published: 8-Jun-2000; LatestRevisionDate: 08-Jul-2005; LatestRevisionNote: Mech Layer 1 removed.; PackageReference: LED-0; Publisher: Altium Limited; PackageDescription: LED; 2 Leads; value: Green
TP4 TP130-TP163 = TP: Test Point; Value: TP

## Nets that join several sheets
+3.3V: TOP (9 pins), HashPower1 (5 pins), HashPower2 (5 pins), HashPower3 (5 pins), HashPower4 (5 pins), HashUnit1 (62 pins), HashUnit2 (68 pins), HashUnit3 (68 pins), HashUnit4 (77 pins)
+12V: TOP (8 pins), HashPower1 (13 pins), HashPower2 (13 pins), HashPower3 (12 pins), HashPower4 (13 pins)
GND: TOP (25 pins), HashPower1 (23 pins), HashPower2 (23 pins), HashPower3 (23 pins), HashPower4 (23 pins), HashUnit1 (345 pins), HashUnit2 (333 pins), HashUnit3 (333 pins), HashUnit4 (327 pins)
VDD1: HashPower1 (9 pins), HashUnit1 (180 pins)
VDD2: HashPower2 (9 pins), HashUnit2 (180 pins)
VDD3: HashPower3 (8 pins), HashUnit3 (180 pins)
VDD4: HashPower4 (9 pins), HashUnit4 (180 pins)
VPLL1: HashPower1 (C16.2 R13.2 TP167.1 U2.5), HashUnit1 (24 pins)
VPLL2: HashPower2 (C563.2 R34.2 TP129.1 U36.5), HashUnit2 (24 pins)
VPLL3: HashPower3 (C579.2 R48.2 TP171.1 U38.5), HashUnit3 (24 pins)
VPLL4: HashPower4 (C595.2 R62.2 TP175.1 U40.5), HashUnit4 (24 pins)
BO8: HashUnit1 (TP32.1 U10.34), HashUnit2 (U11.9)
BO16: HashUnit2 (TP69.1 U18.34), HashUnit3 (U19.9)
BO24: HashUnit3 (TP112.1 U26.34), HashUnit4 (U27.9)
CLK8: HashUnit1 (TP48.1 U10.39), HashUnit2 (U11.1)
CLK16: HashUnit2 (TP82.1 U18.39), HashUnit3 (U19.1)
CLK24: HashUnit3 (TP128.1 U26.39), HashUnit4 (U27.1)
CO8: HashUnit1 (TP39.1 U10.38), HashUnit2 (U11.5)
CO16: HashUnit2 (TP73.1 U18.38), HashUnit3 (U19.5)
CO24: HashUnit3 (TP119.1 U26.38), HashUnit4 (U27.5)
RI8: HashUnit1 (TP40.1 U10.37), HashUnit2 (U11.6)
RI16: HashUnit2 (TP74.1 U18.37), HashUnit3 (U19.6)
RI24: HashUnit3 (TP120.1 U26.37), HashUnit4 (U27.6)
RST8: HashUnit1 (TP47.1 U10.33), HashUnit2 (U11.10)
RST16: HashUnit2 (TP81.1 U18.33), HashUnit3 (U19.10)
RST24: HashUnit3 (TP127.1 U26.33), HashUnit4 (U27.10)
RXD: TOP (J1.3), HashUnit1 (TP27.1 U3.6)
TXD: TOP (J1.5), HashUnit1 (R15.2 TP26.1 U3.5)